# EasyEDA Pro project UAF42_AD620_直流偏置_AD8138全差分.eprj

# Schematic Schematic1

## Sheets
1 P1: Board Name: Board1; Create Date: 2025-03-26; Page Name: P1; Project Name: UAF42_AD620_直流偏置_AD8138全差分; Schematic Name: Schematic1; Update Date: 2025-04-23; Company: 嘉立创EDA; Page Size: A4; Version: V1.0
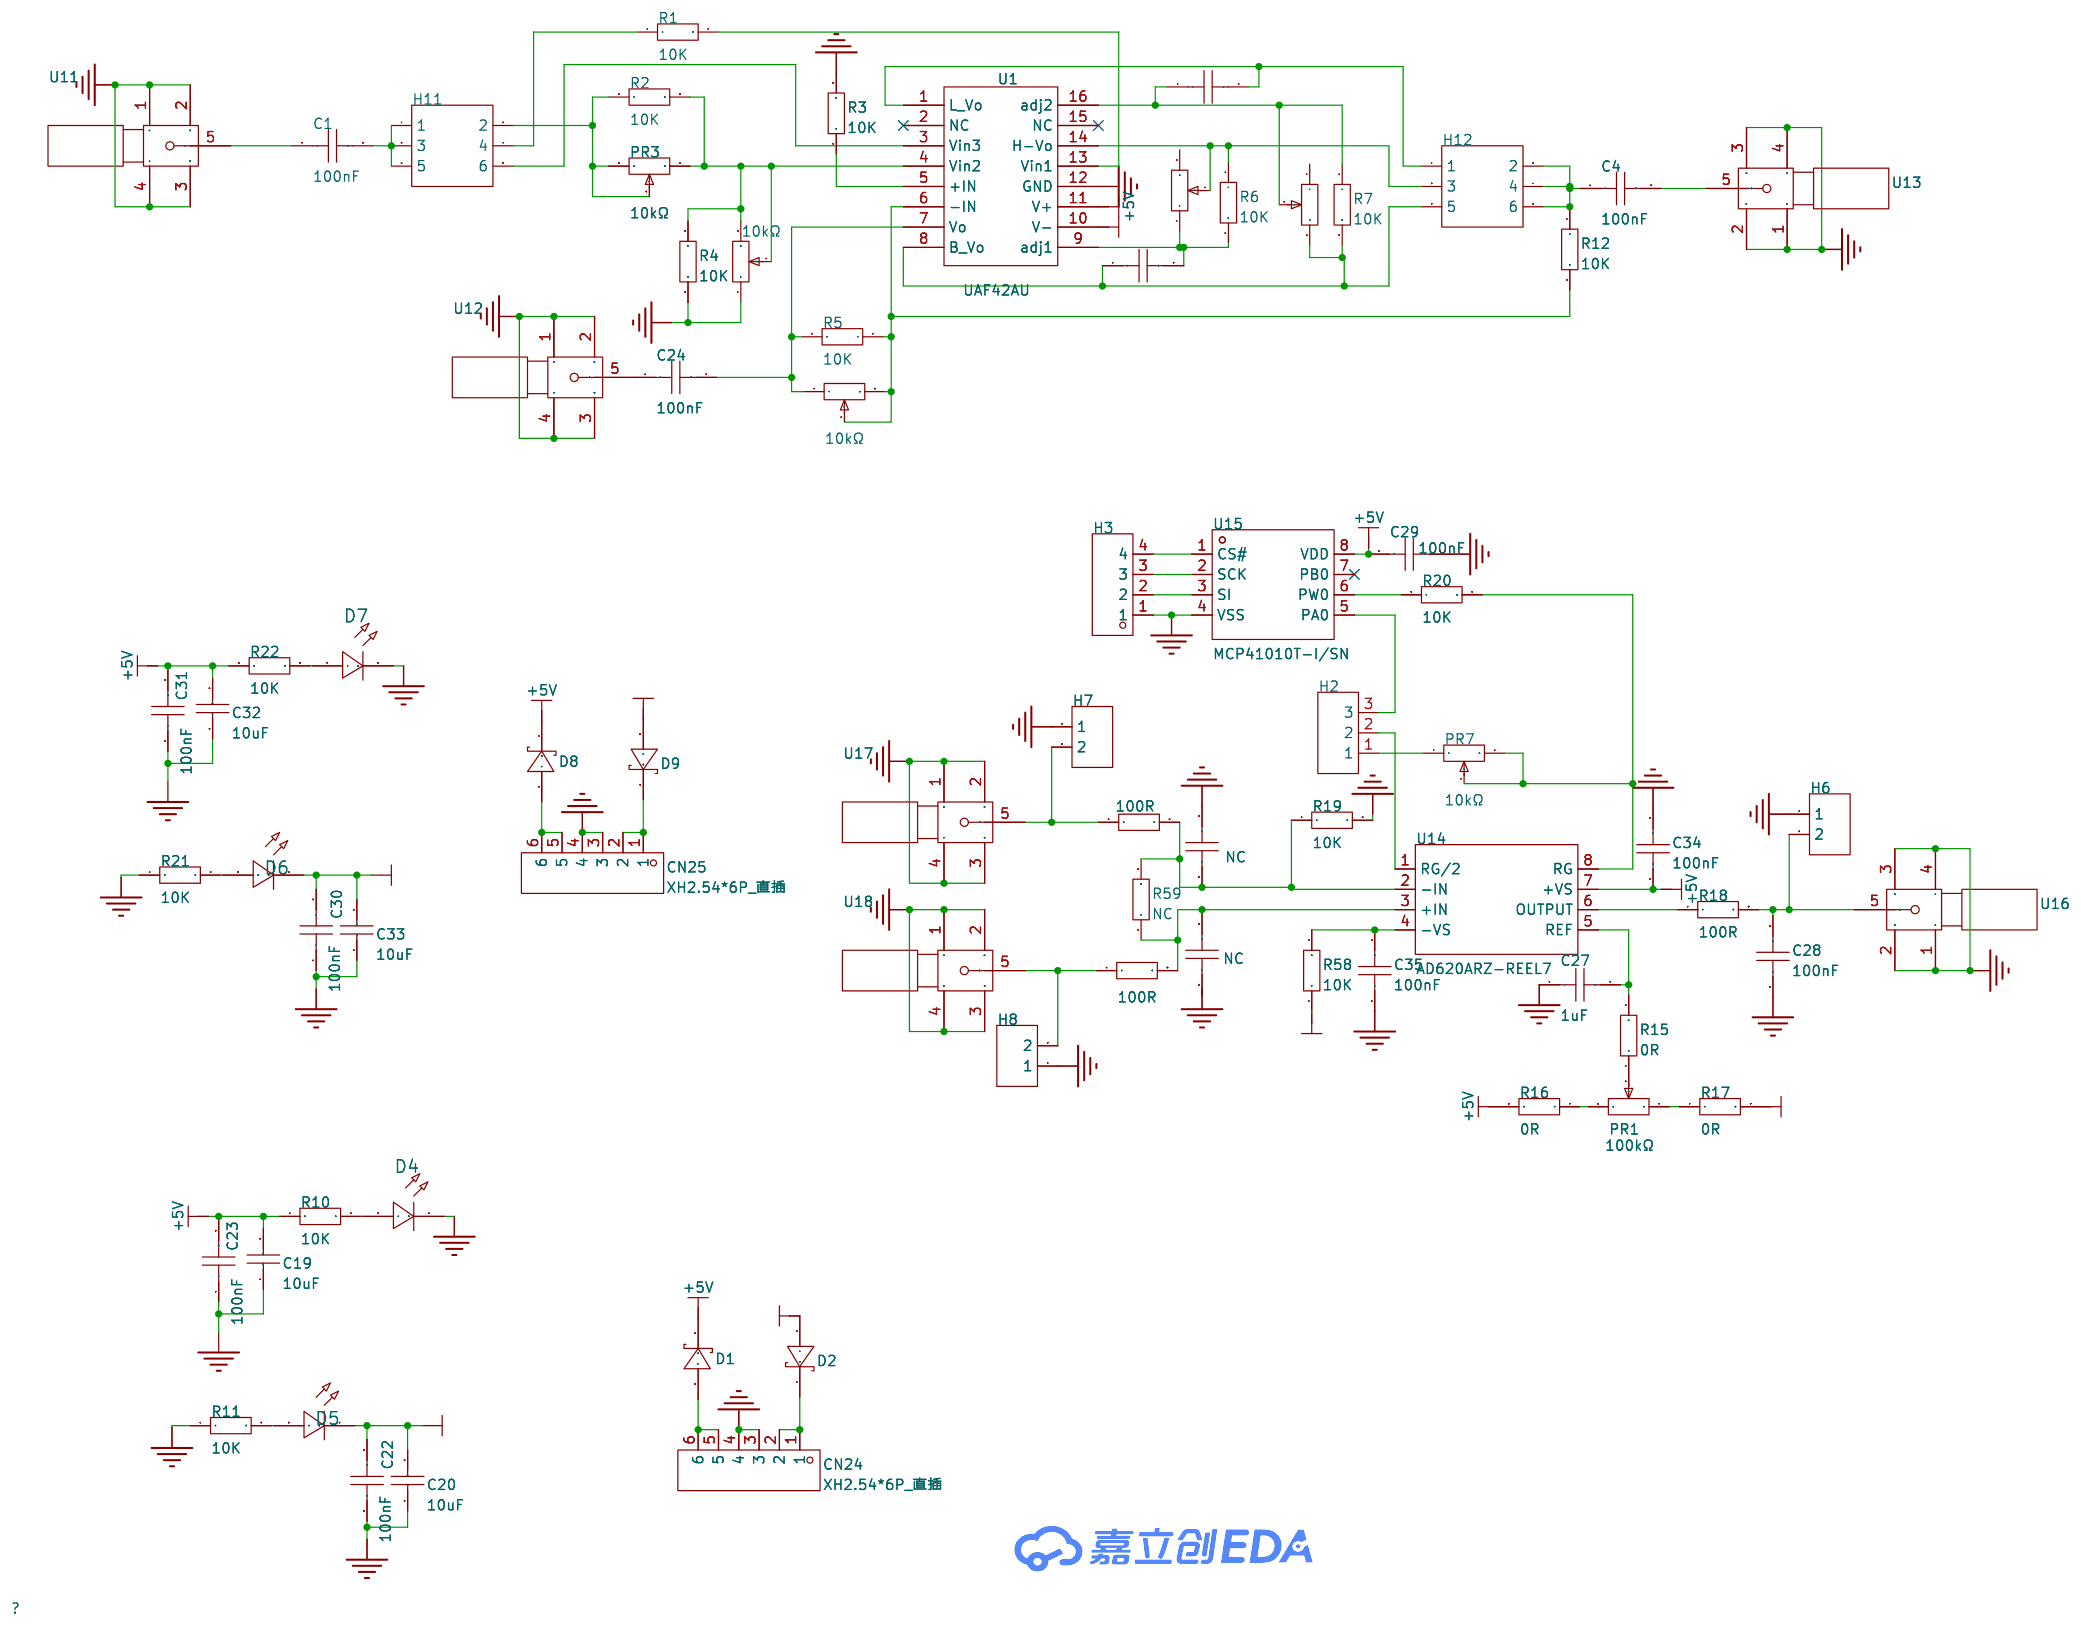
[diagram p0: P1]
2 P2: Create Date: 2025-04-21; Page Name: P2; Update Date: 2025-07-05
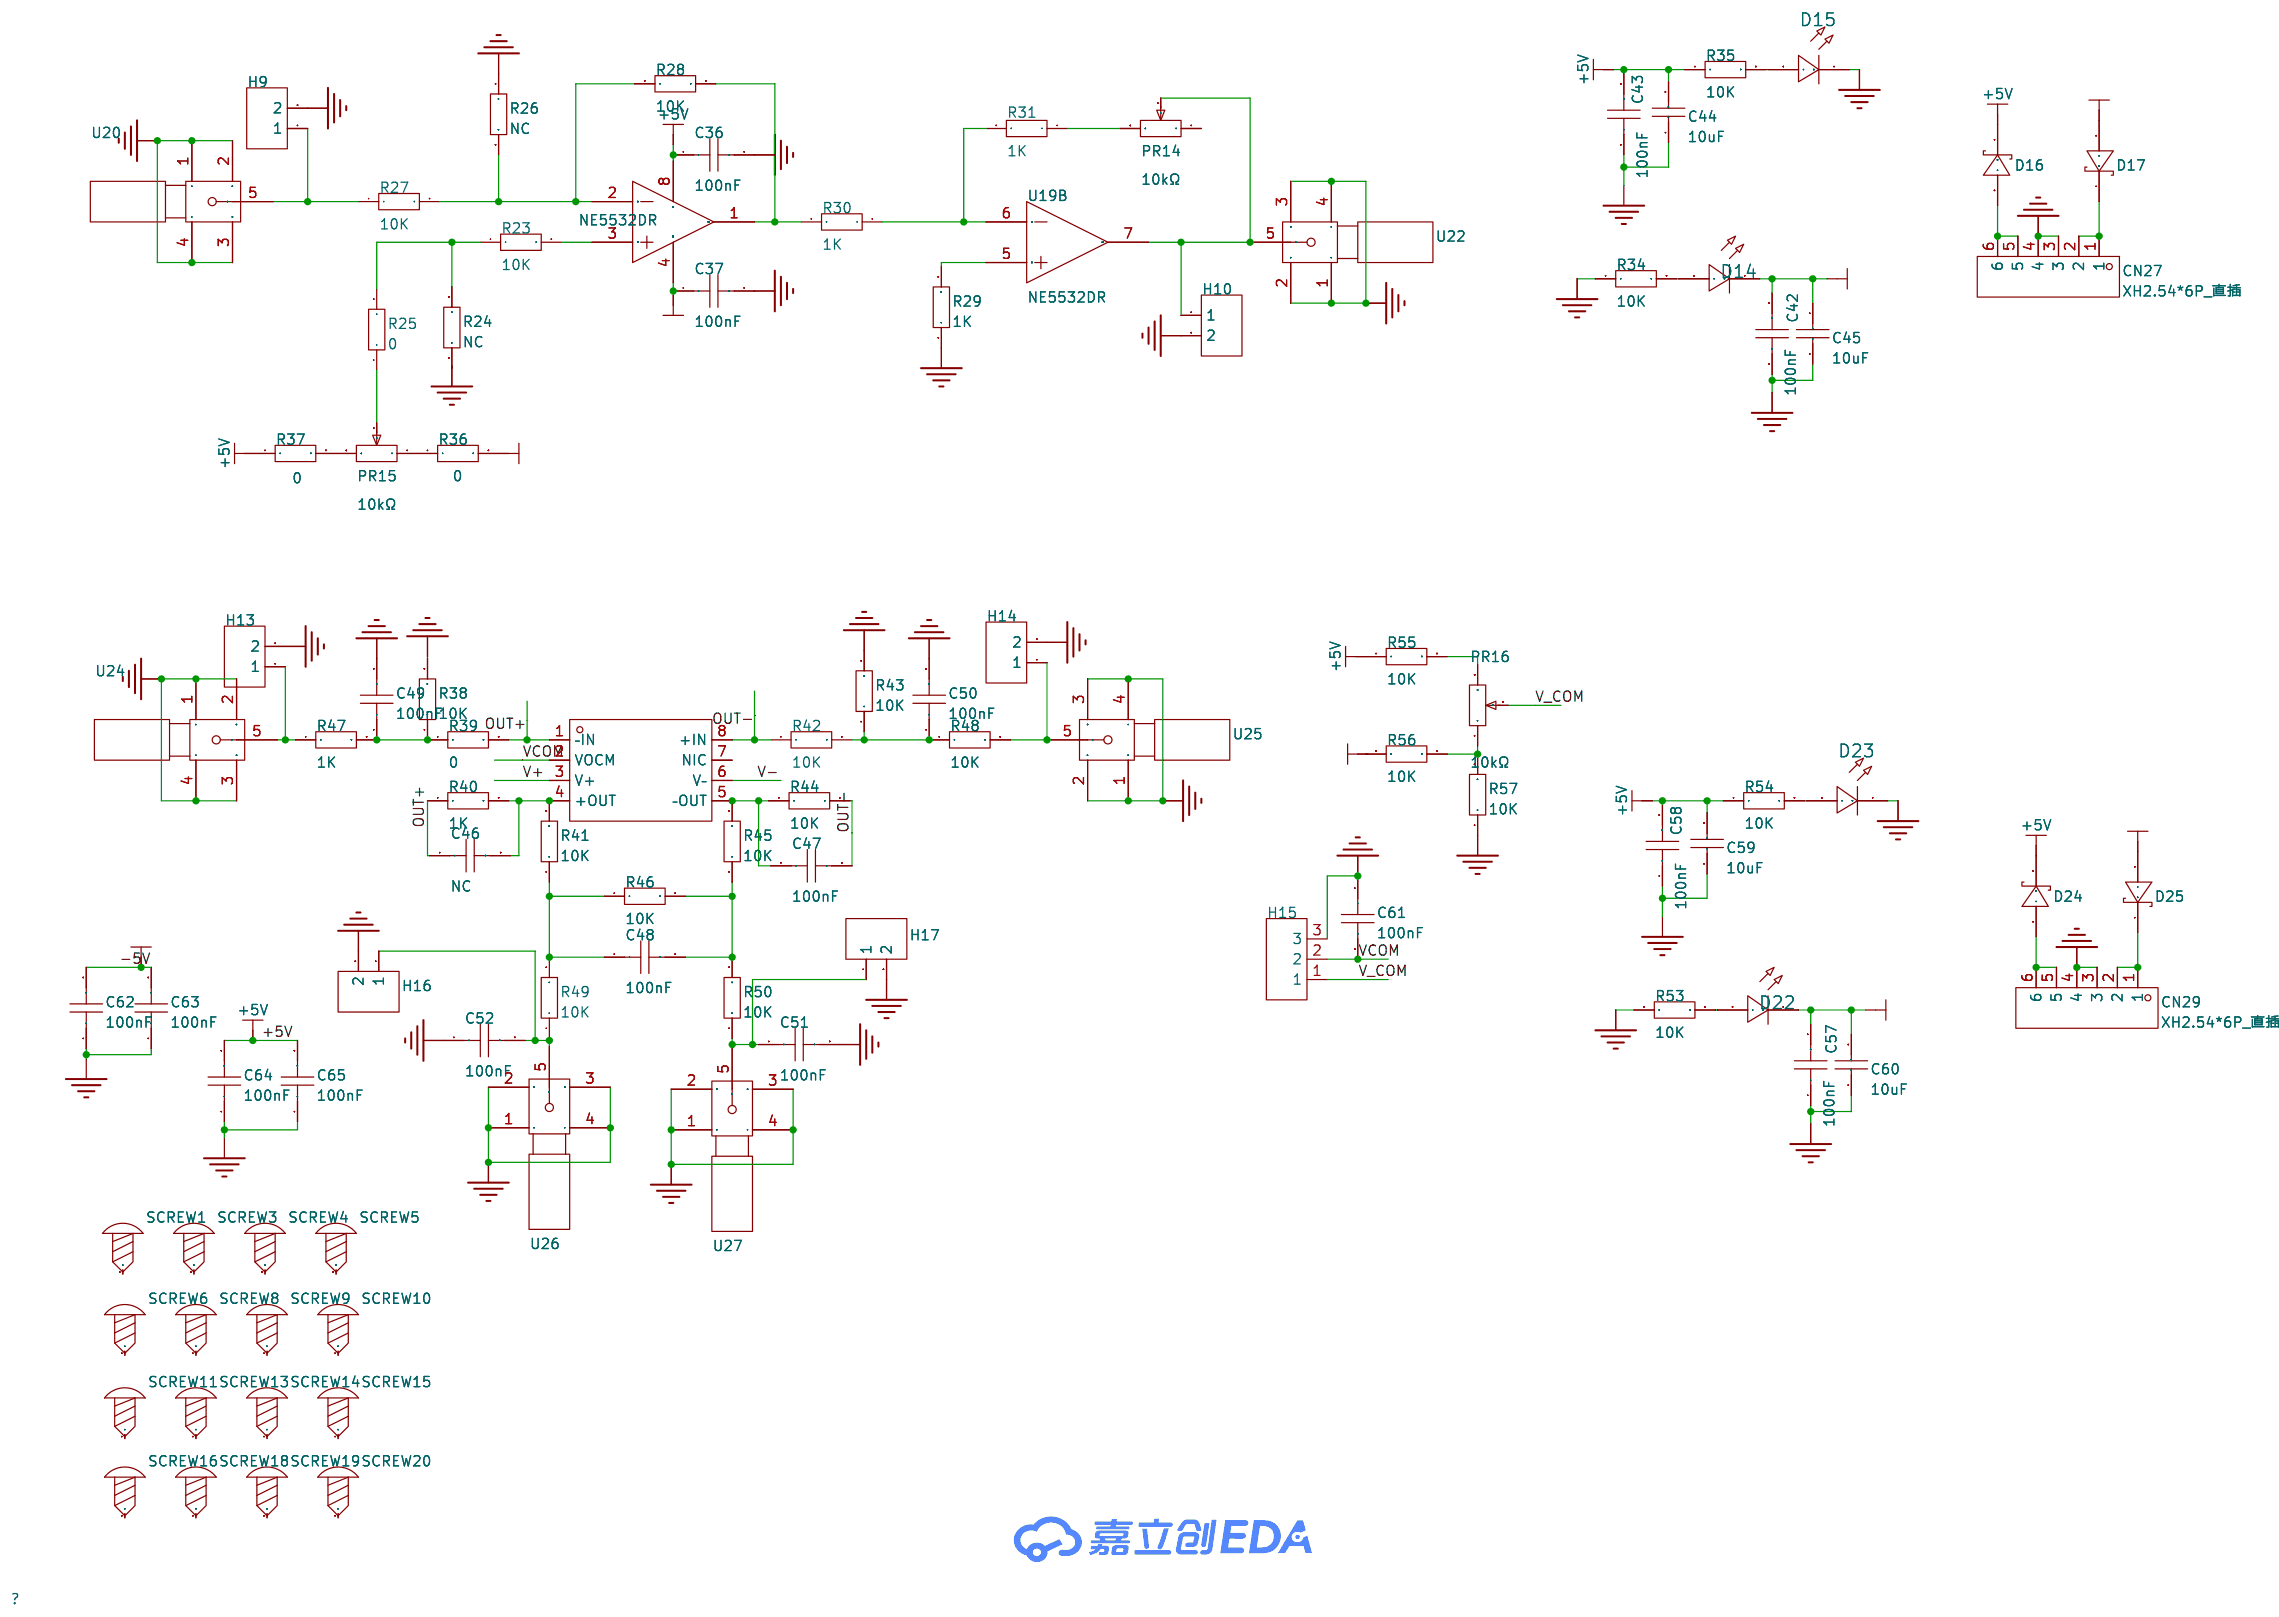
[diagram p1: P2]

## Parts
sheet P1
C1  100nF  [R0805]
C2  100nF  [R0805]
C3  100nF  [R0805]
C4  100nF  [R0805]
C19  10uF  [C1210]
C20  10uF  [C1210]
C22  100nF  [R0805]
C23  100nF  [R0805]
C24  100nF  [R0805]
C25  NC  [R0805]
C26  NC  [R0805]
C27  1uF  [R0805]
C28  100nF  [R0805]
C29  100nF  [R0805]
C30  100nF  [R0805]
C31  100nF  [R0805]
C32  10uF  [C1210]
C33  10uF  [C1210]
C34  100nF  [R0805]
C35  100nF  [R0805]
CN24  XH2.54*6P_直插  [CONN-TH_XH2.54-6P]
CN25  XH2.54*6P_直插  [CONN-TH_XH2.54-6P]
D1  SD103AWS  [SOD-323_L1.8-W1.3-LS2.5-RD]
D2  SD103AWS  [SOD-323_L1.8-W1.3-LS2.5-RD]
D4  -  [LED_0805]
D5  -  [LED_0805]
D6  -  [LED_0805]
D7  -  [LED_0805]
D8  SD103AWS  [SOD-323_L1.8-W1.3-LS2.5-RD]
D9  SD103AWS  [SOD-323_L1.8-W1.3-LS2.5-RD]
H2  -  [HDR-TH_3P-P2.54-V-F]
H3  -  [HDR-TH_4P-P2.54-V-F]
H6  -  [HDR-TH_2P-P2.54-V-F]
H7  -  [HDR-TH_2P-P2.54-V-F]
H8  -  [HDR-TH_2P-P2.54-V-F]
H11  -  [HDR-TH_6P-P2.54-V-F-R2-C3-S2.54]
H12  -  [HDR-TH_6P-P2.54-V-F-R2-C3-S2.54]
PR1  100kΩ  [R_3296]
PR3  10kΩ  [R_3296]
PR4  10kΩ  [R_3296]
PR6  10kΩ  [R_3296]
PR7  10kΩ  [R_3296]
PR9  10kΩ  [R_3296]
PR13  10kΩ  [R_3296]
R1  10K  [R0805]
R2  10K  [R0805]
R3  10K  [R0805]
R4  10K  [R0805]
R5  10K  [R0805]
R6  10K  [R0805]
R7  10K  [R0805]
R10  10K  [R0805]
R11  10K  [R0805]
R12  10K  [R0805]
R13  100R  [R0805]
R14  100R  [R0805]
R15  0R  [R0805]
R16  0R  [R0805]
R17  0R  [R0805]
R18  100R  [R0805]
R19  10K  [R0805]
R20  10K  [R0805]
R21  10K  [R0805]
R22  10K  [R0805]
R58  10K  [R0805]
R59  NC  [R0805]
U1  UAF42AU  [SOIC-16_L10.3-W7.5-P1.27-LS10.3-BL]
U11  -  [SMA]
U12  -  [SMA]
U13  -  [SMA]
U14  AD620ARZ-REEL7  [SOIC-8_L5.0-W4.0-P1.27-LS6.0-BL]
U15  MCP41010T-I/SN  [SOIC-8_L4.9-W3.9-P1.27-LS6.0-BL]
U16  -  [SMA]
U17  -  [SMA]
U18  -  [SMA]
sheet P2
C36  100nF  [R0805]
C37  100nF  [R0805]
C42  100nF  [R0805]
C43  100nF  [R0805]
C44  10uF  [C1210]
C45  10uF  [C1210]
C46  NC  [R0805]
C47  100nF  [R0805]
C48  100nF  [R0805]
C49  100nF  [R0805]
C50  100nF  [R0805]
C51  100nF  [R0805]
C52  100nF  [R0805]
C57  100nF  [R0805]
C58  100nF  [R0805]
C59  10uF  [C1210]
C60  10uF  [C1210]
C61  100nF  [R0805]
C62  100nF  [R0805]
C63  100nF  [R0805]
C64  100nF  [R0805]
C65  100nF  [R0805]
CN27  XH2.54*6P_直插  [CONN-TH_XH2.54-6P]
CN29  XH2.54*6P_直插  [CONN-TH_XH2.54-6P]
D14  -  [LED_0805]
D15  -  [LED_0805]
D16  SD103AWS  [SOD-323_L1.8-W1.3-LS2.5-RD]
D17  SD103AWS  [SOD-323_L1.8-W1.3-LS2.5-RD]
D22  -  [LED_0805]
D23  -  [LED_0805]
D24  SD103AWS  [SOD-323_L1.8-W1.3-LS2.5-RD]
D25  SD103AWS  [SOD-323_L1.8-W1.3-LS2.5-RD]
H9  -  [HDR-TH_2P-P2.54-V-F]
H10  -  [HDR-TH_2P-P2.54-V-F]
H13  -  [HDR-TH_2P-P2.54-V-F]
H14  -  [HDR-TH_2P-P2.54-V-F]
H15  -  [HDR-TH_3P-P2.54-V-F]
H16  -  [HDR-TH_2P-P2.54-V-F]
H17  -  [HDR-TH_2P-P2.54-V-F]
PR14  10kΩ  [R_3296]
PR15  10kΩ  [R_3296]
PR16  10kΩ  [R_3296]
R23  10K  [R0805]
R24  NC  [R0805]
R25  0  [R0805]
R26  NC  [R0805]
R27  10K  [R0805]
R28  10K  [R0805]
R29  1K  [R0805]
R30  1K  [R0805]
R31  1K  [R0805]
R34  10K  [R0805]
R35  10K  [R0805]
R36  0  [R0805]
R37  0  [R0805]
R38  10K  [R0805]
R39  0  [R0805]
R40  1K  [R0805]
R41  10K  [R0805]
R42  10K  [R0805]
R43  10K  [R0805]
R44  10K  [R0805]
R45  10K  [R0805]
R46  10K  [R0805]
R47  1K  [R0805]
R48  10K  [R0805]
R49  10K  [R0805]
R50  10K  [R0805]
R53  10K  [R0805]
R54  10K  [R0805]
R55  10K  [R0805]
R56  10K  [R0805]
R57  10K  [R0805]
SCREW1  -  [M3螺丝]
SCREW3  -  [M3螺丝]
SCREW4  -  [M3螺丝]
SCREW5  -  [M3螺丝]
SCREW6  -  [M3螺丝]
SCREW8  -  [M3螺丝]
SCREW9  -  [M3螺丝]
SCREW10  -  [M3螺丝]
SCREW11  -  [M3螺丝]
SCREW13  -  [M3螺丝]
SCREW14  -  [M3螺丝]
SCREW15  -  [M3螺丝]
SCREW16  -  [M3螺丝]
SCREW18  -  [M3螺丝]
SCREW19  -  [M3螺丝]
SCREW20  -  [M3螺丝]
U19  NE5532DR  [SOIC-8_L4.9-W3.9-P1.27-LS6.0-BL]  (sections 1,2)
U20  -  [SMA]
U22  -  [SMA]
U23  AD8138ARZ-RL  [SOIC-8_L5.0-W4.0-P1.27-LS6.0-BL]
U24  -  [SMA]
U25  -  [SMA]
U26  -  [SMA]
U27  -  [SMA]

## Library data of the parts
C1-C4 C22-C31 C34-C37 C42 C43 C46-C52 C57 C58 C61-C65 = CAP_0805: Supplier Footprint: 0805
C19 C20 C32 C33 C44 C45 C59 C60 = CL32B106KAJNNNE: 容值:10uF;精度:±10%;额定电压:25V;材质(温度系数):X7R;; LCSC Part Name: 10uF ±10% 25V; Supplier Part: C39232; Manufacturer: SAMSUNG(三星); Supplier Footprint: 1210; JLCPCB Part Class: 扩展库; Datasheet: https://atta.szlcsc.com/upload/public/pdf/source/20160218/1457707763339.pdf; Supplier: LCSC; Tolerance: ±10%; Voltage Rated: 25V; Temperature Coefficient: X7R
CN24 CN25 CN27 CN29 = XH2.54*6P_直插: Supplier Part: C9900008614; Supplier Footprint: XH2.54_6P; JLCPCB Part Class: 扩展库; Supplier: LCSC
D1 D2 D8 D9 D16 D17 D24 D25 = SD103AWS_C181207: 正向压降(Vf):600mV@200mA;直流反向耐压(Vr):40V;整流电流:350mA;; LCSC Part Name: 电压:40V 电流:350mA 丝印S4; Supplier Part: C181207; Manufacturer: Hottech(合科泰); Supplier Footprint: SOD-323; JLCPCB Part Class: 扩展库; Datasheet: https://atta.szlcsc.com/upload/public/pdf/source/20240513/4691873FBB9173EFBCF4C6FD4BBA1025.pdf; Supplier: LCSC; Forward Voltage (Vf@If): 600mV@200mA; Reverse Voltage (Vr): 40V; Rectified Current: 350mA
D4-D7 D14 D15 D22 D23 = LED_0805-R: Supplier Footprint: 0805
H2 H15 = HDR-F_2.54_1x3P: Supplier Part: C541850; Supplier Footprint: 插件
H3 = HDR-F_2.54_1x4P: Supplier Part: C2718488; Supplier Footprint: 插件
H6-H10 H13 H14 H16 H17 = HDR-F_2.54_1x2P: Supplier Part: C49661; Supplier Footprint: 插件
H11 H12 = HDR-F_2.54_2x3: Supplier Part: C92272; Supplier Footprint: 插件
PR1 PR3 PR4 PR6 PR7 PR9 PR13-PR16 = R_3296: Supplier Footprint: 直插
R1-R7 R10-R31 R34-R50 R53-R59 = Res_0805: Supplier Footprint: 0805
U1 = UAF42AU: 分辨率:-;工作电压:6V~18V;接口类型:-;; Supplier Part: C12341; Manufacturer: TI(德州仪器); Supplier Footprint: SOIC-16-300mil; JLCPCB Part Class: 扩展库; Datasheet: https://www.ti.com/cn/lit/gpn/uaf42; Supplier: LCSC; Voltage - Supply: 6V~18V; Operating Temperature: -25℃~+85℃
U11-U13 U16-U18 U20 U22 U24-U27 = SMA
U14 = AD620ARZ-REEL7: LCSC Part Name: 低成本低功耗仪表放大器; Supplier Part: C9675; Manufacturer: ADI(亚德诺); Supplier Footprint: SOIC-8; JLCPCB Part Class: Extended Part; Datasheet: https://atta.szlcsc.com/upload/public/pdf/source/20121103/1457706545320.pdf; Supplier: LCSC; Number of Circuits: 单路; Current - Input Bias(Ib): 500pA; Voltage - Input Offset(Vos): 30uV; Slew Rate(SR): 1.2V/us; -3db Bandwidth: 1MHz; Operating Temperature: -40℃~+85℃
U15 = MCP41010T-I/SN: Supplier Part: C136395; Manufacturer: MICROCHIP(美国微芯); Supplier Footprint: SOIC-8-150mil; JLCPCB Part Class: 扩展库; Datasheet: https://atta.szlcsc.com/upload/public/pdf/source/20220205/C2666606_C5E8E7A5F3891B321C1555D845654E7B.pdf; Supplier: LCSC; Resistance Value (Ohms): 10kΩ; Number of Taps: 256; Number of Channels: 1; Precision: ±20%; Supply Voltage: 2.7V~5.5V; Interface Type: SPI; Temperature Coefficient (Typ): 800ppm/℃; Operating Temperature: -40℃~+85℃
SCREW1 SCREW3-SCREW6 SCREW8-SCREW11 SCREW13-SCREW16 SCREW18-SCREW20 = M3螺丝: Supplier Footprint: 插件
U19 = NE5532DR: Supplier Part: C7426; Manufacturer: TI(德州仪器); Supplier Footprint: SOIC-8; JLCPCB Part Class: 基础库; Datasheet: http://www.ti.com/cn/lit/gpn/ne5532; Supplier: LCSC; Number of Circuits: 双路; Gain Bandwidth Product(GBP): 10MHz; Current - Input Bias(Ib): 200nA; Slew Rate(SR): 9V/us; Output Current: 38mA; Supply Current: 8mA; Operating Temperature: 0℃~+70℃
U23 = AD8138ARZ-RL: LCSC Part Name: 低失真差分ADC驱动器; Supplier Part: C652360; Manufacturer: ADI(亚德诺); Supplier Footprint: SOIC-8; JLCPCB Part Class: 扩展库; Datasheet: https://atta.szlcsc.com/upload/public/pdf/source/20181012/C116011_0AC99E88246DC0EB027D01E9C456B8D0.pdf; Supplier: LCSC; Number of Circuits: 单路; Common Mode Rejection Ratio (CMRR): 77dB; Current - Input Bias(Ib): 500nA; Voltage - Input Offset(Vos): 1mV; Slew Rate(SR): 1150V/us; Supply Voltage: 3V~5V; -3db Bandwidth: 320MHz; Output Current: 95mA; Input Offset Voltage Drift (Vos TC): 4uV/℃; Supply Current: 20mA; Operating Temperature: -40℃~+85℃

## Nets
+5V: C19.2 C23.2 C29.1 C31.2 C32.2 C34.1 C36.1 C43.2 C44.2 C58.2 C59.2 C64.2 C65.2 D1.1(C) D8.1(C) D16.1(C) D24.1(C) R10.1 R16.2 R22.1 R35.1 R37.1 R54.1 R55.1 U1.11(V+) U14.7(+VS) U15.8(VDD) U19.8(VCC+)
-5V: C20.2 C22.2 C30.2 C33.2 C37.1 C42.2 C45.2 C57.2 C60.2 C62.2 C63.2 D2.2(A) D5.1(C) D6.1(C) D9.2(A) D14.1(C) D17.2(A) D22.1(C) D25.2(A) R17.2 R36.2 R56.2 R58.1 U1.10(V-) U19.4(VCC-/GND)
GND: C19.1 C20.1 C22.1 C23.1 C25.2 C26.1 C27.1 C28.1 C29.2 C30.1 C31.1 C32.1 C33.1 C34.2 C35.1 C36.2 C37.2 C42.1 C43.1 C44.1 C45.1 C49.2 C50.2 C51.2 C52.1 C57.1 C58.1 C59.1 C60.1 C61.1 C62.1 C63.1 C64.1 C65.1 CN24.3 CN24.4 CN25.3 CN25.4 CN27.3 CN27.4 CN29.3 CN29.4 D4.1(C) D7.1(C) D15.1(C) D23.1(C) H3.1 H6.1 H7.1 H8.1 H9.2 H10.2 H13.2 H14.2 H15.3 H16.2 H17.2 PR9.1 R3.2 R4.1 R11.1 R19.2 R21.1 R24.1 R26.1 R29.1 R34.1 R38.2 R43.2 R53.1 R57.1 U1.12(GND) U11.1 U11.2 U11.3 U11.4 U12.1 U12.2 U12.3 U12.4 U13.1 U13.2 U13.3 U13.4 U15.4(VSS) U16.1 U16.2 U16.3 U16.4 U17.1 U17.2 U17.3 U17.4 U18.1 U18.2 U18.3 U18.4 U20.1 U20.2 U20.3 U20.4 U22.1 U22.2 U22.3 U22.4 U24.1 U24.2 U24.3 U24.4 U25.1 U25.2 U25.3 U25.4 U26.1 U26.2 U26.3 U26.4 U27.1 U27.2 U27.3 U27.4
OUT+: C46.1 R39.2 R40.1 U23.1(–IN)
OUT-: C47.2 R42.1 R44.2 U23.8(+IN)
V+: U23.3(V+)
V-: U23.6(V–)
V_COM: H15.1 PR16.2
VCOM: C61.2 H15.2 U23.2(VOCM)
$1N1182: D5.2(A) R11.2
$1N1188: D4.2(A) R10.2
$1N1389: CN24.5 CN24.6 D1.2(A)
$1N1390: CN24.1 CN24.2 D2.1(C)
$1N1445: R3.1 U1.5(+IN)
$1N1450: R1.2 U1.13(Vin1)
$1N1595: PR3.3 PR9.2 PR9.3 R2.2 R4.2 U1.4(Vin2)
$1N1622: H11.2 PR3.1 PR3.2 R2.1
$1N1784: PR13.2 PR13.3 R5.1 R12.2 U1.6(-IN)
$1N1790: C24.2 PR13.1 R5.2 U1.7(Vo)
$1N1856: H11.6 U1.3(Vin3)
$1N1869: H11.4 R1.1
$1N1910: C2.2 H12.1 U1.1(L_Vo)
$1N1976: C2.1 PR6.2 R7.1 U1.16(adj2)
$1N1981: H12.3 PR4.2 R6.1 U1.14(H-Vo)
$1N2040: C3.2 PR4.1 R6.2 U1.9(adj1)
$1N2142: C4.1 H12.2 H12.4 H12.6 R12.1
$1N2254: C3.1 H12.5 PR6.3 R7.2 U1.8(B_Vo)
$1N2357: C1.2 H11.1 H11.3 H11.5
$1N2379: C1.1 U11.5
$1N2488: C24.1 U12.5
$1N2539: C4.2 U13.5
$1N3084: C25.1 R13.2 R19.1 R59.2 U14.2(-IN)
$1N3090: C26.2 R14.2 R59.1 U14.3(+IN)
$1N3242: R18.1 U14.6(OUTPUT)
$1N3248: C27.2 R15.2 U14.5(REF)
$1N3433: H2.2 U14.1(RG/2)
$1N3547: PR7.2 PR7.3 R20.2 U14.8(RG)
$1N3556: H2.3 U15.5(PA0)
$1N3634: R20.1 U15.6(PW0)
$1N3650: PR1.2 R15.1
$1N3654: PR1.3 R16.1
$1N3658: PR1.1 R17.1
$1N3766: C28.2 H6.2 R18.2 U16.5
$1N3943: H7.2 R13.1 U17.5
$1N3949: H8.2 R14.1 U18.5
$1N4144: H3.4 U15.1(CS#)
$1N4148: H3.3 U15.2(SCK)
$1N4153: H3.2 U15.3(SI)
$1N4622: D7.2(A) R22.2
$1N4631: D6.2(A) R21.2
$1N4633: CN25.1 CN25.2 D9.1(C)
$1N4634: CN25.5 CN25.6 D8.2(A)
$1N4767: C35.2 R58.2 U14.4(-VS)
$1N5205: H2.1 PR7.1
$2N1502: H9.1 R27.1 U20.5
$2N1503: R26.2 R27.2 R28.1 U19.2(IN1-)
$2N1504: R23.1 R24.2 R25.2
$2N1511: CN27.5 CN27.6 D16.2(A)
$2N1513: D14.2(A) R34.2
$2N1515: D15.2(A) R35.2
$2N1521: PR15.1 R36.1
$2N1522: PR15.2 R25.1
$2N1523: PR15.3 R37.2
$2N1527: R28.2 R30.2 U19.1(OUT1)
$2N1528: R30.1 R31.2 U19.6(IN2-)
$2N1531: PR14.3 R31.1
$2N1533: R29.2 U19.5(IN2+)
$2N1535: H10.1 PR14.2 U19.7(OUT2) U22.5
$2N1536: R23.2 U19.3(IN1+)
$2N1574: CN27.1 CN27.2 D17.1(C)
$2N2025: C46.2 R40.2 R41.2 U23.4(+OUT)
$2N2050: C47.1 R44.1 R45.2 U23.5(–OUT)
$2N2321: C48.1 R41.1 R46.1 R49.2
$2N2326: C48.2 R45.1 R46.2 R50.2
$2N2399: C50.1 R42.2 R43.1 R48.1
$2N2476: C49.1 R38.1 R39.1 R47.2
$2N2511: H13.1 R47.1 U24.5
$2N2915: H14.1 R48.2 U25.5
$2N3082: C51.1 H17.1 R50.1 U27.5
$2N3086: C52.2 H16.1 R49.1 U26.5
$2N3632: CN29.5 CN29.6 D24.2(A)
$2N3637: D22.2(A) R53.2
$2N3640: D23.2(A) R54.2
$2N3643: CN29.1 CN29.2 D25.1(C)
$2N3838: PR16.1 R56.1 R57.2
$2N3844: PR16.3 R55.2

Not connected (* = marked no-connect by the designer): PR4 3; PR6 1; PR14 1; SCREW1 1; SCREW3 1; SCREW4 1; SCREW5 1; SCREW6 1; SCREW8 1; SCREW9 1; SCREW10 1; SCREW11 1; SCREW13 1; SCREW14 1; SCREW15 1; SCREW16 1; SCREW18 1; SCREW19 1; SCREW20 1; U1 2(NC)* 15(NC)*; U15 7(PB0)*; U23 7(NIC)

# Board PCB1
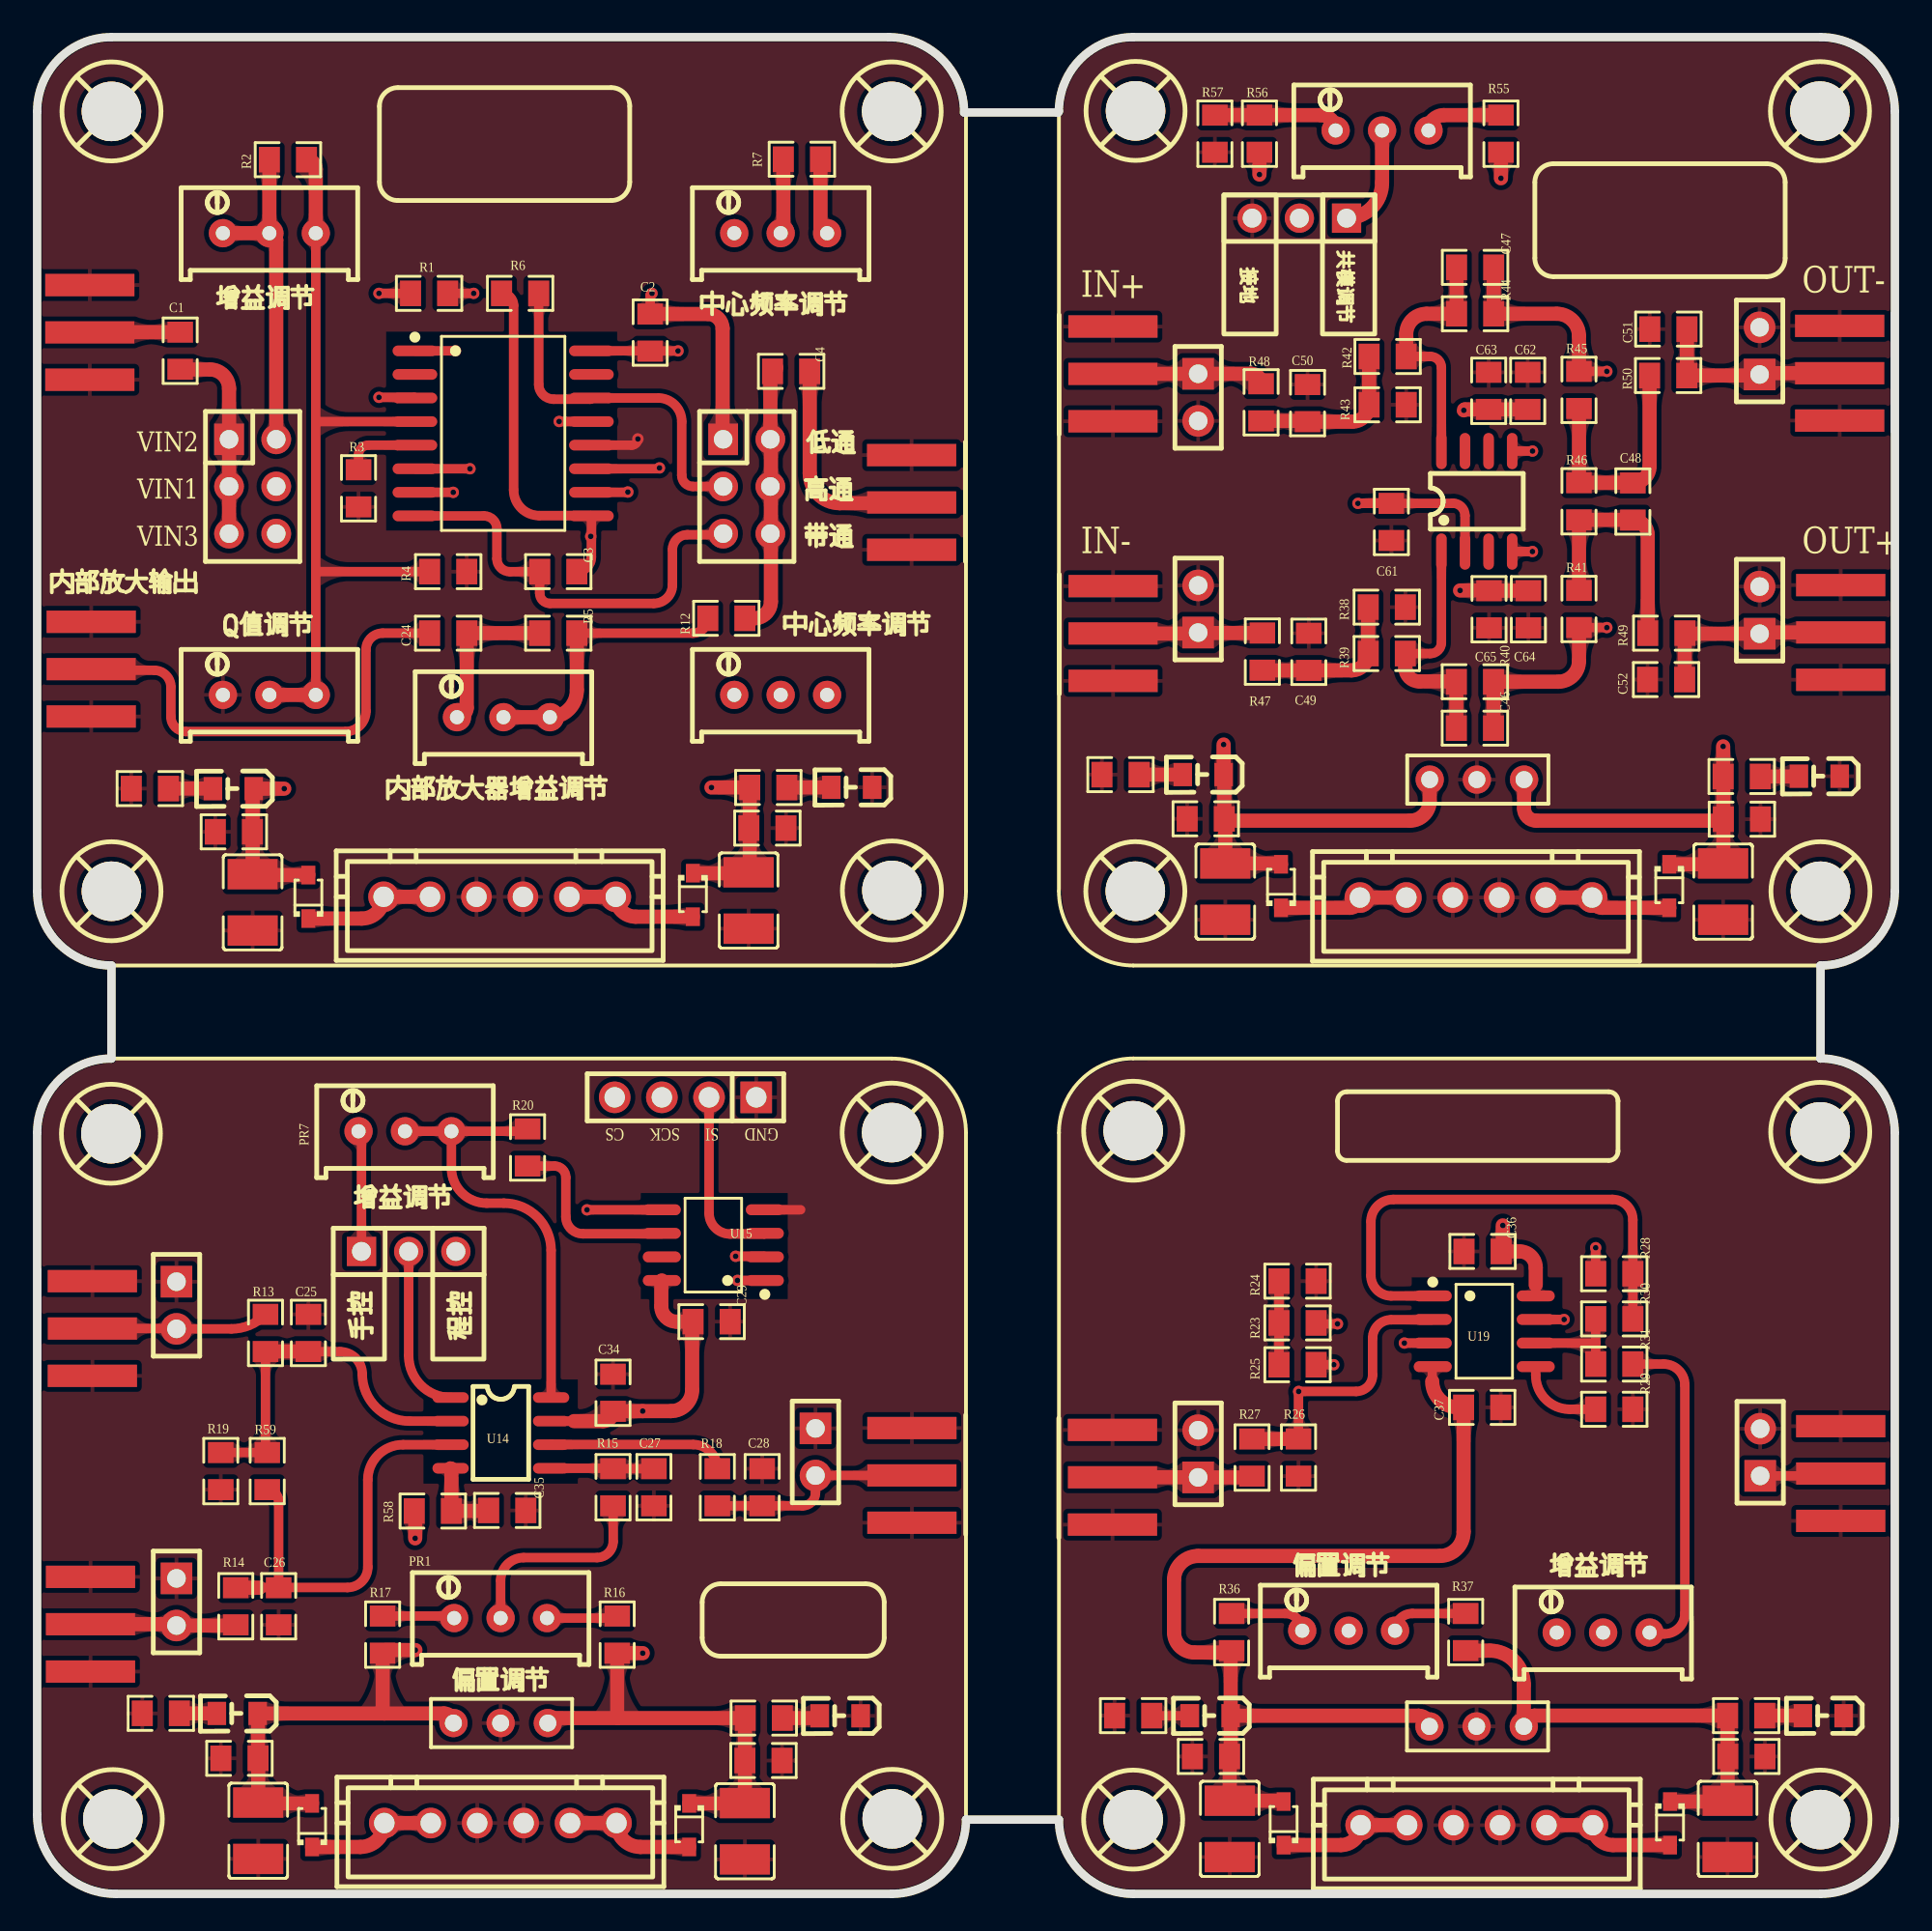
[diagram p2: board, top side]
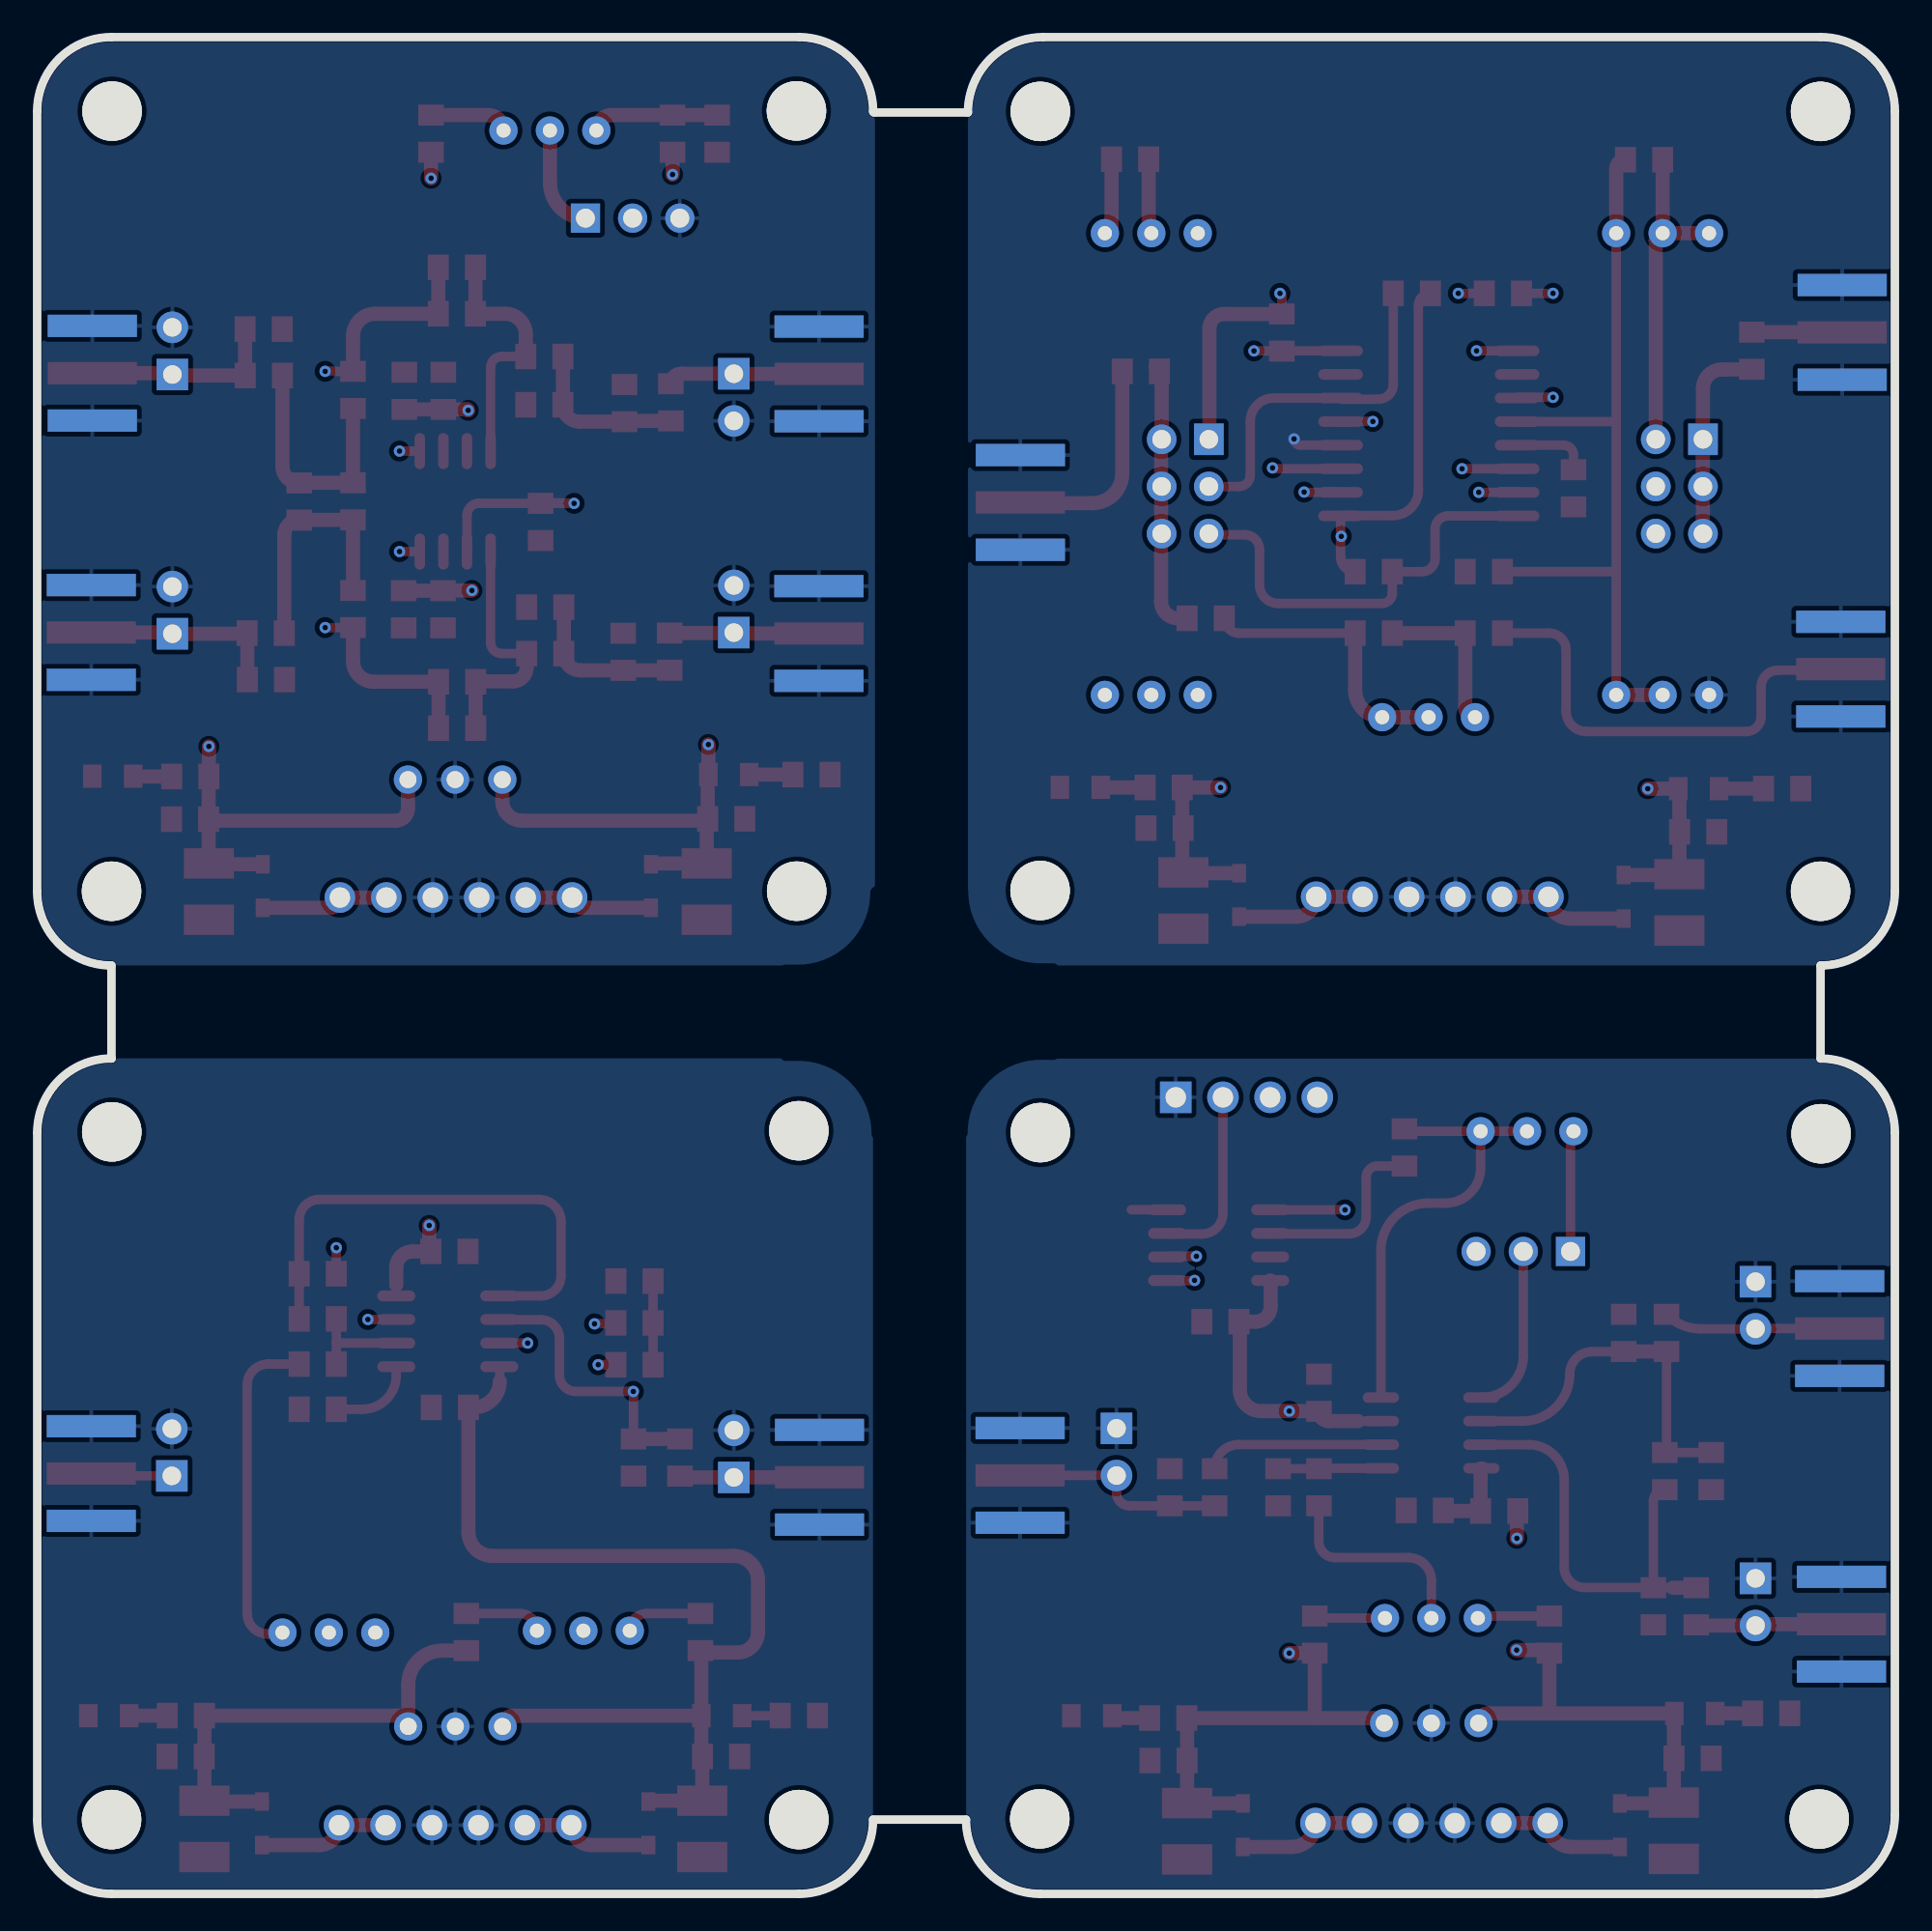
[diagram p3: board, bottom side, seen from below]

Outline 100 x 100 mm; copper layers: Top Layer, 内层1, Inner2, Bottom Layer. Coordinates in mm from the lower left corner of the outline.
Outline path: 0,96 arc(1.17,98.83) 4,100 45.84,100 arc(48.71,98.81) 49.9,95.94 54.94,95.94 arc(54.99,95.96) 55,96 arc(56.18,98.83) 59,100 96,100 arc(98.83,98.83) 100,96 100,54 arc(98.83,51.17) 96,50 96,45 arc(96,44.99) 96,44.99 arc(98.83,43.82) 100,40.99 100,4 arc(98.83,1.17) 96,0 59.01,0 arc(56.18,1.17) 55.01,4 50,4 arc(48.83,1.17) 46,0 4.25,0 arc(1.25,1.25) 0,4.25 0,40.99 arc(1.17,43.82) 4,44.99 4,50 arc(1.17,51.17) 0,54 0,96
Stack: Top Layer 0.035mm 外层铜厚1oz / Dielectric1 0.2104mm 7628 RC49% 8.6mil / 内层1 0.0152mm 内层铜厚 / Dielectric2 1.065mm 1.1mm H/HOZ Copper / Inner2 0.0152mm 内层铜厚 / Dielectric3 0.2104mm 7628 RC49% 8.6mil / Bottom Layer 0.035mm 外层铜厚1oz

## Design rules (mm)
template: 自定义配置
spacing copperThickness1oz (default): track to track 0.102, other pairs 0.152 to 0.3
spacing copperThickness2oz: track to track 0.203, other pairs 0.152 to 0.3
track width copperThickness1oz (default): min 0.127, default 0.508, max 2.54
track width copperThickness2oz: min 0.203, default 0.254, max 2.54
differential pair differentialPair (default): width min 0.127, default 0.254, max 2.54; gap min 0.152, default 0.152
via viaSize (default): diameter min 0.5, default 0.61, max 10; hole min 0.3, default 0.305, max 6.3

## Placement (name value [footprint] x y rotation side)
C1  100nF  [R0805]  7.7 83 270 top
C2  100nF  [R0805]  33 84.2 90 top
C3  100nF  [R0805]  28.16 71.21 0 top
C4  100nF  [R0805]  40.7 82 0 top
C19  10uF  [C1210]  38.3 53.5 90 top
C20  10uF  [C1210]  11.6 53.4 90 top
C22  100nF  [R0805]  10.7 57.2 0 top
C23  100nF  [R0805]  39.2 57.4 180 top
C24  100nF  [R0805]  22.24 67.9 0 top
C25  NC  [R0805]  14.6 30.32 90 top
C26  NC  [R0805]  13 15.6 90 top
C27  1uF  [R0805]  33.2 22.01 90 top
C28  100nF  [R0805]  39.03 21.79 270 top
C29  100nF  [R0805]  36.42 30.82 0 top
C30  100nF  [R0805]  11 7.3 0 top
C31  100nF  [R0805]  38.99 7.18 180 top
C32  10uF  [C1210]  38.1 3.37 90 top
C33  10uF  [C1210]  11.9 3.4 90 top
C34  100nF  [R0805]  31 27.1 90 top
C35  100nF  [R0805]  25.19 20.65 180 top
C36  100nF  [R0805]  77.7 34.6 180 top
C37  100nF  [R0805]  77.9 26.2 0 top
C42  100nF  [R0805]  63.3 7.4 0 top
C43  100nF  [R0805]  91.9 7.4 180 top
C44  10uF  [C1210]  91 3.5 90 top
C45  10uF  [C1210]  64.2 3.5 90 top
C46  NC  [R0805]  77.51 62.78 0 top
C47  100nF  [R0805]  77.3 87.6 180 top
C48  100nF  [R0805]  85.9 75.1 90 top
C49  100nF  [R0805]  68.46 67.01 90 top
C50  100nF  [R0805]  68.39 80.4 90 top
C51  100nF  [R0805]  87.7 84.28 180 top
C52  100nF  [R0805]  87.8 65.4 0 top
C57  100nF  [R0805]  63.02 57.9 0 top
C58  100nF  [R0805]  91.66 57.88 180 top
C59  10uF  [C1210]  90.76 53.98 90 top
C60  10uF  [C1210]  63.96 53.98 90 top
C61  100nF  [R0805]  72.9 74 90 top
C62  100nF  [R0805]  80.24 80.84 270 top
C63  100nF  [R0805]  78.14 80.84 270 top
C64  100nF  [R0805]  80.28 69.3 90 top
C65  100nF  [R0805]  78.16 69.3 90 top
CN24  XH2.54*6P_直插  [CONN-TH_XH2.54-6P]  24.9 53.7 0 top
CN25  XH2.54*6P_直插  [CONN-TH_XH2.54-6P]  24.94 3.81 0 top
CN27  XH2.54*6P_直插  [CONN-TH_XH2.54-6P]  77.5 3.7 0 top
CN29  XH2.54*6P_直插  [CONN-TH_XH2.54-6P]  77.46 53.66 0 top
D1  SD103AWS  [SOD-323_L1.8-W1.3-LS2.5-RD]  35.3 53.8 270 top
D2  SD103AWS  [SOD-323_L1.8-W1.3-LS2.5-RD]  14.6 53.7 90 top
D4  -  [LED_0805]  43.8 59.6 180 top
D5  -  [LED_0805]  10.51 59.53 180 top
D6  -  [LED_0805]  10.72 9.72 180 top
D7  -  [LED_0805]  43.18 9.59 180 top
D8  SD103AWS  [SOD-323_L1.8-W1.3-LS2.5-RD]  35.1 3.7 270 top
D9  SD103AWS  [SOD-323_L1.8-W1.3-LS2.5-RD]  14.8 3.7 90 top
D14  -  [LED_0805]  63.1 9.6 180 top
D15  -  [LED_0805]  96.1 9.6 180 top
D16  SD103AWS  [SOD-323_L1.8-W1.3-LS2.5-RD]  87.9 3.8 270 top
D17  SD103AWS  [SOD-323_L1.8-W1.3-LS2.5-RD]  67.1 3.8 90 top
D22  -  [LED_0805]  62.72 60.29 180 top
D23  -  [LED_0805]  95.88 60.2 180 top
D24  SD103AWS  [SOD-323_L1.8-W1.3-LS2.5-RD]  87.86 54.28 270 top
D25  SD103AWS  [SOD-323_L1.8-W1.3-LS2.5-RD]  66.96 54.28 90 top
H2  -  [HDR-TH_3P-P2.54-V-F]  20 34.6 0 top
H3  -  [HDR-TH_4P-P2.54-V-F]  34.9 42.9 180 top
H6  -  [HDR-TH_2P-P2.54-V-F]  41.9 23.8 270 top
H7  -  [HDR-TH_2P-P2.54-V-F]  7.5 31.7 270 top
H8  -  [HDR-TH_2P-P2.54-V-F]  7.5 15.72 270 top
H9  -  [HDR-TH_2P-P2.54-V-F]  62.5 23.7 90 top
H10  -  [HDR-TH_2P-P2.54-V-F]  92.75 23.78 90 top
H11  -  [HDR-TH_6P-P2.54-V-F-R2-C3-S2.54]  11.6 75.8 270 top
H12  -  [HDR-TH_6P-P2.54-V-F-R2-C3-S2.54]  38.2 75.8 270 top
H13  -  [HDR-TH_2P-P2.54-V-F]  62.5 69.2 90 top
H14  -  [HDR-TH_2P-P2.54-V-F]  62.5 80.6 270 top
H15  -  [HDR-TH_3P-P2.54-V-F]  67.95 90.25 180 top
H16  -  [HDR-TH_2P-P2.54-V-F]  92.72 69.14 90 top
H17  -  [HDR-TH_2P-P2.54-V-F]  92.72 83.1 90 top
NOREF  -  [Pad_e98]  27.49 9.2 0 top
NOREF#2  -  [Pad_e201]  74.95 9.02 0 top
NOREF#3  -  [Pad_e200]  80.03 9.02 0 top
NOREF#4  -  [Pad_e275]  80.04 60.01 0 top
NOREF#5  -  [Pad_e95]  22.41 9.2 0 top
NOREF#6  -  [Pad_e96]  24.95 9.2 0 top
NOREF#7  -  [Pad_e262]  74.96 60.01 0 top
NOREF#8  -  [Pad_e199]  77.49 9.02 0 top
NOREF#9  -  [Pad_e263]  77.5 60.01 0 top
PR1  100kΩ  [R_3296]  24.95 14.98 0 top
PR3  10kΩ  [R_3296]  12.5 89.57 0 top
PR4  10kΩ  [R_3296]  40.03 64.7 0 top
PR6  10kΩ  [R_3296]  40.03 89.57 0 top
PR7  10kΩ  [R_3296]  19.8 41.2 0 top
PR9  10kΩ  [R_3296]  12.5 64.7 0 top
PR13  10kΩ  [R_3296]  25.1 63.5 0 top
PR14  10kΩ  [R_3296]  84.3 14.2 0 top
PR15  10kΩ  [R_3296]  70.6 14.3 0 top
PR16  10kΩ  [R_3296]  72.4 95.1 0 top
R1  10K  [R0805#2]  21.1 86.2 0 top
R2  10K  [R0805#2]  13.5 93.4 0 top
R3  10K  [R0805#2]  17.3 75.7 270 top
R4  10K  [R0805#2]  22.13 71.21 180 top
R5  10K  [R0805#2]  28.05 67.9 180 top
R6  10K  [R0805#2]  26 86.2 180 top
R7  10K  [R0805#2]  41.17 93.42 0 top
R10  10K  [R0805#2]  39.36 59.59 0 top
R11  10K  [R0805#2]  6.07 59.53 0 top
R12  10K  [R0805#2]  37.1 68.7 180 top
R13  100R  [R0805#2]  12.29 30.21 270 top
R14  100R  [R0805#2]  10.69 15.49 90 top
R15  0R  [R0805#2]  31 21.9 90 top
R16  0R  [R0805#2]  31.22 13.96 270 top
R17  0R  [R0805#2]  18.6 13.96 270 top
R18  100R  [R0805#2]  36.62 21.9 270 top
R19  10K  [R0805#2]  9.89 22.77 270 top
R20  10K  [R0805#2]  26.4 40.2 90 top
R21  10K  [R0805#2]  6.66 9.72 0 top
R22  10K  [R0805#2]  39.12 9.47 0 top
R23  10K  [R0805#2]  67.85 30.75 0 top
R24  NC  [R0805#2]  67.85 33 180 top
R25  0  [R0805#2]  67.85 28.5 180 top
R26  NC  [R0805#2]  67.9 23.5 90 top
R27  10K  [R0805#2]  65.4 23.5 90 top
R28  10K  [R0805#2]  84.9 33.4 0 top
R29  1K  [R0805#2]  84.9 26.1 180 top
R30  1K  [R0805#2]  84.9 30.97 0 top
R31  1K  [R0805#2]  84.9 28.53 180 top
R34  10K  [R0805#2]  59 9.6 0 top
R35  10K  [R0805#2]  92 9.6 0 top
R36  0  [R0805#2]  64.3 14.1 270 top
R37  0  [R0805#2]  76.9 14.1 90 top
R38  10K  [R0805#2]  72.65 69.3 0 top
R39  0  [R0805#2]  72.65 66.8 0 top
R40  1K  [R0805#2]  77.4 65.28 0 top
R41  10K  [R0805#2]  83 69.2 270 top
R42  10K  [R0805#2]  72.7 82.8 180 top
R43  10K  [R0805#2]  72.7 80.2 0 top
R44  10K  [R0805#2]  77.41 85.1 180 top
R45  10K  [R0805#2]  83 81 90 top
R46  10K  [R0805#2]  83 75 90 top
R47  1K  [R0805#2]  65.96 66.91 270 top
R48  10K  [R0805#2]  65.89 80.33 90 top
R49  10K  [R0805#2]  87.7 67.9 180 top
R50  10K  [R0805#2]  87.8 81.78 180 top
R53  10K  [R0805#2]  58.32 60.28 0 top
R54  10K  [R0805#2]  91.76 60.18 0 top
R55  10K  [R0805#2]  78.8 94.8 90 top
R56  10K  [R0805#2]  65.8 94.8 270 top
R57  10K  [R0805#2]  63.4 94.8 90 top
R58  10K  [R0805#2]  21.3 20.62 0 top
R59  NC  [R0805#2]  12.39 22.77 90 top
SCREW1  -  [M3螺丝]  46 41 0 top
SCREW3  -  [M3螺丝]  96 54 0 top
SCREW4  -  [M3螺丝]  59.12 54 0 top
SCREW5  -  [M3螺丝]  4 96 0 top
SCREW6  -  [M3螺丝]  96 4 0 top
SCREW8  -  [M3螺丝]  59 41.1 0 top
SCREW9  -  [M3螺丝]  95.97 96.02 0 top
SCREW10  -  [M3螺丝]  46 96 0 top
SCREW11  -  [M3螺丝]  59 4 0 top
SCREW13  -  [M3螺丝]  59.13 96.03 0 top
SCREW14  -  [M3螺丝]  4.07 4.03 0 top
SCREW15  -  [M3螺丝]  4 54 0 top
SCREW16  -  [M3螺丝]  95.99 41.04 0 top
SCREW18  -  [M3螺丝]  46.03 4.04 0 top
SCREW19  -  [M3螺丝]  3.97 40.94 0 top
SCREW20  -  [M3螺丝]  46.01 54.04 0 top
U1  UAF42AU  [SOIC-16_L10.3-W7.5-P1.27-LS10.3-BL]  25.09 78.66 270 top
U11  -  [SMA]  -0.97 78.24 0 top
U12  -  [SMA]  -0.9 60.1 0 top
U13  -  [SMA]  50.88 80.8 180 top
U14  AD620ARZ-REEL7  [SOIC-8_L5.0-W4.0-P1.27-LS6.0-BL]  24.96 24.83 270 top
U15  MCP41010T-I/SN  [SOIC-8_L4.9-W3.9-P1.27-LS6.0-BL]  36.4 34.94 90 top
U16  -  [SMA]  50.9 28.4 180 top
U17  -  [SMA]  -0.84 24.59 0 top
U18  -  [SMA]  -0.94 8.66 0 top
U19  NE5532DR  [SOIC-8_L4.9-W3.9-P1.27-LS6.0-BL]  77.9 30.3 270 top
U20  -  [SMA]  54.08 16.57 0 top
U22  -  [SMA]  100.9 28.5 180 top
U23  AD8138ARZ-RL  [SOIC-8_L5.0-W4.0-P1.27-LS6.0-BL]  77.5 75 0 top
U24  -  [SMA]  54.11 62.02 0 top
U25  -  [SMA]  54.1 76 0 top
U26  -  [SMA]  100.9 73.8 180 top
U27  -  [SMA]  100.84 87.76 180 top

## Footprints (pads in the part's own frame, mm; a bottom-side part is the same pattern mirrored in y, then rotated)
C1210
  rect 1.635x2.7 smd: 1(-1.518,0) 2(1.518,0)
CONN-TH_XH2.54-6P
  round 1.65 hole 1.1: 1(-6.25,0) 2(-3.75,0) 3(-1.25,0) 4(1.25,0) 5(3.75,0) 6(6.25,0)
HDR-TH_2P-P2.54-V-F
  rect 1.7x1.7 hole 1: 1(-1.27,0)
  round 1.7 hole 1: 2(1.27,0)
HDR-TH_3P-P2.54-V-F
  rect 1.575x1.575 hole 1.02: 1(-2.54,0)
  round 1.575 hole 1.02: 2(0,0) 3(2.54,0)
HDR-TH_4P-P2.54-V-F
  rect 1.7x1.7 hole 1.1: 1(-3.81,0)
  round 1.7 hole 1.1: 2(-1.27,0) 3(1.27,0) 4(3.81,0)
HDR-TH_6P-P2.54-V-F-R2-C3-S2.54
  rect 1.7x1.6 hole 1: 1(-2.54,-1.27)
  round 1.6 hole 1: 2(-2.54,1.27) 3(0,-1.27) 4(0,1.27) 5(2.54,-1.27) 6(2.54,1.27)
LED_0805
  rect 1x1.25 smd: 1(-1.15,0.005) 2(1.05,0.005)
M3螺丝
  round 3.2 hole 3.2: 1(0,0)
Pad_e95
  round 1.524 hole 0.914: 1(0,0)
Pad_e96
  round 1.524 hole 0.914: 2(0,0)
Pad_e98
  round 1.524 hole 0.914: 1(0,0)
Pad_e199
  round 1.524 hole 0.914: 2(0,0)
Pad_e200
  round 1.524 hole 0.914: 1(0,0)
Pad_e201
  round 1.524 hole 0.914: 1(0,0)
Pad_e262
  round 1.524 hole 0.914: 1(0,0)
Pad_e263
  round 1.524 hole 0.914: 2(0,0)
Pad_e275
  round 1.524 hole 0.914: 1(0,0)
R0805
  rect 1.133x1.377 smd: 1(-1.111,0) 2(0.889,0)
R0805#2
  rect 1.133x1.377 smd: 1(-1,0) 2(1,0)
R_3296
  round 1.524 hole 0.762: 1(-2.499,-0.127) 2(0,-0.127) 3(2.499,-0.127)
SMA
  rect 4.8x1.2 smd: 1(3.81,8.412) 2(3.81,3.312) 5(3.81,5.862)
  rect 4.8x1.2 smd far side: 3(3.81,3.312) 4(3.81,8.412)
SOD-323_L1.8-W1.3-LS2.5-RD
  rect 1x0.75 smd: 1(-1.173,0) 2(1.173,0)
SOIC-8_L4.9-W3.9-P1.27-LS6.0-BL
  oval 0.588x2.045 smd: 1(-1.905,-2.772) 2(-0.635,-2.772) 3(0.635,-2.772) 4(1.905,-2.772) 5(1.905,2.772) 6(0.635,2.772) 7(-0.635,2.772) 8(-1.905,2.772)
SOIC-8_L5.0-W4.0-P1.27-LS6.0-BL
  oval 0.569x1.95 smd: 1(-1.905,-2.705) 2(-0.635,-2.705) 3(0.635,-2.705) 4(1.905,-2.705) 5(1.905,2.705) 6(0.635,2.705) 7(-0.635,2.705) 8(-1.905,2.705)
SOIC-16_L10.3-W7.5-P1.27-LS10.3-BL
  oval 0.574x2.401 smd: 1(-4.445,-4.75) 2(-3.175,-4.75) 3(-1.905,-4.75) 4(-0.635,-4.75) 5(0.635,-4.75) 6(1.905,-4.75) 7(3.175,-4.75) 8(4.445,-4.75) 9(4.445,4.75) 10(3.175,4.75) 11(1.905,4.75) 12(0.635,4.75) 13(-0.635,4.75) 14(-1.905,4.75) 15(-3.175,4.75) 16(-4.445,4.75)

## Nets
As in the schematic, except:
+5V: C19.2 C23.2 C29.1 C31.2 C32.2 C34.1 C36.1 C43.2 C44.2 C58.2 C59.2 C64.2 C65.2 D1.1 D8.1 D16.1 D24.1 NOREF.1 NOREF#3.1 NOREF#4.1 R10.1 R16.2 R22.1 R35.1 R37.1 R54.1 R55.1 U1.11 U14.7 U15.8 U19.8
-5V: C20.2 C22.2 C30.2 C33.2 C37.1 C42.2 C45.2 C57.2 C60.2 C62.2 C63.2 D2.2 D5.1 D6.1 D9.2 D14.1 D17.2 D22.1 D25.2 NOREF#2.1 NOREF#5.1 NOREF#7.1 R17.2 R36.2 R56.2 R58.1 U1.10 U19.4
GND: C19.1 C20.1 C22.1 C23.1 C25.2 C26.1 C27.1 C28.1 C29.2 C30.1 C31.1 C32.1 C33.1 C34.2 C35.1 C36.2 C37.2 C42.1 C43.1 C44.1 C45.1 C49.2 C50.2 C51.2 C52.1 C57.1 C58.1 C59.1 C60.1 C61.1 C62.1 C63.1 C64.1 C65.1 CN24.3 CN24.4 CN25.3 CN25.4 CN27.3 CN27.4 CN29.3 CN29.4 D4.1 D7.1 D15.1 D23.1 H3.1 H6.1 H7.1 H8.1 H9.2 H10.2 H13.2 H14.2 H15.3 H16.2 H17.2 NOREF#6.2 NOREF#8.2 NOREF#9.2 PR9.1 R3.2 R4.1 R11.1 R19.2 R21.1 R24.1 R26.1 R29.1 R34.1 R38.2 R43.2 R53.1 R57.1 U1.12 U11.1 U11.2 U11.3 U11.4 U12.1 U12.2 U12.3 U12.4 U13.1 U13.2 U13.3 U13.4 U15.4 U16.1 U16.2 U16.3 U16.4 U17.1 U17.2 U17.3 U17.4 U18.1 U18.2 U18.3 U18.4 U20.1 U20.2 U20.3 U20.4 U22.1 U22.2 U22.3 U22.4 U24.1 U24.2 U24.3 U24.4 U25.1 U25.2 U25.3 U25.4 U26.1 U26.2 U26.3 U26.4 U27.1 U27.2 U27.3 U27.4

Pads without a net: PR4 3; PR6 1; PR14 1; SCREW1 1; SCREW3 1; SCREW4 1; SCREW5 1; SCREW6 1; SCREW8 1; SCREW9 1; SCREW10 1; SCREW11 1; SCREW13 1; SCREW14 1; SCREW15 1; SCREW16 1; SCREW18 1; SCREW19 1; SCREW20 1; U1 2 15; U15 7; U23 7

## Via types
v1: diameter 0.61, hole 0.305, Top Layer to Bottom Layer, 40 vias

## Routing (per net, layer and track width the routed paths; a pad name or vN(x,y) marks a point on that pad's centre or on a via; arc(x,y) is an arc through that point)
+5V: length 215.4
  Top Layer w0.508: 80.67,32.2 80.67,32.8 ; U14.7 28.9,25.46 ; U1.11 33.4,76.75
  Top Layer w0.762: D8.1 38.08,4.87 arc(38.1,4.88) C32.2 C31.2 38.1,9.45 arc(38.1,9.46) R22.1 31.26,9.47 ; v1(90.76,61.8) R54.1 arc(90.77,60.18) 90.77,60.17 C58.2 ; 31.26,9.47 27.76,9.47 arc(27.57,9.39) NOREF.1 ; 31.26,9.47 arc(31.23,9.48) 31.22,9.5 R16.2 v1(32.6,12.96) ; C58.2 90.77,55.51 arc(90.77,55.5) C59.2 arc(90.75,55.47) 90.72,55.45 D24.1 ; C58.2 arc(90.75,57.82) 90.69,57.8 80.7,57.8 arc(80.24,57.99) 80.04,58.46 NOREF#4.1 ; 28.9,25.46 30.47,25.46 arc(30.85,25.62) C34.1 arc(31,26) 31.01,26 v1(32.6,26) 34.11,26 arc(34.92,26.34) 35.26,27.15 35.26,30.77 arc(35.27,30.8) C29.1 34.42,30.82 arc(33.84,31.06) 33.6,31.64 33.6,33.01 arc(33.61,33.03) U15.8 ; v1(78.9,36) 78.9,34.69 arc(78.87,34.63) 78.81,34.6 79.8,34.6 arc(80.42,34.34) 80.67,33.73 80.67,32.8 ; v1(78.8,92.4) 78.8,93.6 78.9,93.7 arc(78.87,93.77) R55.1 ; D1.1 38.25,54.97 arc(38.29,54.99) C19.2 arc(38.34,55.04) 38.36,55.08 R10.1 v1(36.3,59.59) ; v1(76.6,70.2) 78.15,70.2 arc(78.15,70.2) C65.2 ; 80.38,70.19 78.26,70.19 ; R37.1 78.2,13.1 arc(79.49,12.56) 80.03,11.27 NOREF#3.1 arc(80.2,9.43) 80.61,9.6 R35.1 C44.2 arc(90.99,4.99) 90.96,4.97 D16.1
  内层1 w0.762: v1(36.3,59.59) 35.01,59.59 arc(33.94,60.03) 33.5,61.1 v1(33.5,76.8)
  Inner2 w0.762: v1(78.8,92.4) 78.8,79.4 arc(78.45,78.55) 77.6,78.2 77.5,78.2 arc(76.86,77.94) 76.6,77.3 v1(76.6,70.2) 76.6,67.5 arc(76.86,66.86) 77.5,66.6 89.5,66.6 arc(90.39,66.23) 90.76,65.34 v1(90.76,61.8) ; v1(32.6,12.96) v1(32.6,26) ; v1(78.9,36) 78.9,10.15 arc(79.23,9.35) NOREF#3.1
-5V: length 211.5
  Top Layer w0.508: U1.10 31.8,75.48 ; 75.1,27.6 75.1,28.37 arc(75.11,28.39) U19.4
  Top Layer w0.762: D14.1 74.37,9.59 arc(74.78,9.43) NOREF#2.1 ; D14.1 64.25,7.46 arc(64.23,7.42) 64.19,7.4 arc(64.2,7.4) 64.2,7.39 C45.2 67.06,5.02 arc(67.09,5) D17.2 ; D14.1 64.25,13.01 ; NOREF#7.1 74.96,58.86 arc(74.65,58.11) 73.9,57.8 64.01,57.8 arc(63.98,57.8) 63.96,57.81 ; v1(13.3,59.52) D5.1 arc(11.62,59.5) 11.6,59.46 C20.2 arc(11.61,54.89) 11.64,54.87 D2.2 ; v1(20.35,19.15) 20.35,20.57 arc(20.34,20.61) R58.1 ; 18.69,9.72 D6.1 arc(11.88,9.71) 11.89,9.7 C30.2 arc(11.9,7.3) 11.9,7.29 C33.2 arc(11.91,4.89) 11.94,4.87 D9.2 ; 18.69,9.72 21.89,9.72 arc(22.26,9.57) NOREF#5.1 ; 18.69,9.72 arc(18.62,9.74) 18.6,9.8 R17.2 arc(18.65,13.08) 18.76,13.13 v1(20.36,13.13) ; 64.25,13.01 arc(64.23,13) 64.2,13 62.3,13 arc(61.52,13.32) 61.2,14.1 61.2,16.9 arc(61.58,17.82) 62.5,18.2 75.5,18.2 arc(76.41,18.58) 76.79,19.49 76.79,26.2 76.5,26.2 arc(75.51,26.61) 75.1,27.6 ; 64.25,13.01 arc(64.29,13.05) R36.2 ; v1(65.8,92.6) R56.2 ; C62.2 C63.2 76.85,79.95 arc(76.81,79.94) v1(76.8,79.9) ; v1(63.87,61.9) D22.1 arc(63.9,60.27) 63.91,60.25 63.91,57.9 arc(63.92,57.85) 63.96,57.81 ; 63.96,57.81 C60.2 66.92,55.5 arc(66.95,55.48) D25.2
  内层1 w0.762: v1(13.3,59.52) 29.26,59.52 arc(31.06,60.27) 31.8,62.06 v1(31.8,75.5)
  Inner2 w0.762: v1(20.36,13.13) 20.36,19.14 arc(20.36,19.15) v1(20.35,19.15) ; v1(63.87,61.9) 72.1,61.9 arc(73.16,62.34) 73.6,63.4 73.6,79.1 arc(73.83,79.67) 74.4,79.9 v1(76.8,79.9) 76.8,91.3 arc(76.42,92.22) 75.5,92.6 v1(65.8,92.6)
GND: length 4.6
  Top Layer w0.508: U15.4 41.1,36.84 ; U1.12 32,78.02 arc(32.24,78.12) v1(32.34,78.36)
OUT+: length 13.6
  Top Layer w0.508: R39.2 75,66.8 arc(75.42,66.97) 75.59,67.39 U23.1
  Top Layer w0.762: R39.2 73.65,66.05 arc(73.87,65.52) 74.4,65.3 76.38,65.3 arc(76.39,65.3) R40.1 C46.1
OUT-: length 13.8
  Top Layer w0.508: R42.1 75,82.8 arc(75.42,82.63) 75.59,82.2 U23.8
  Top Layer w0.762: C47.2 R44.2 arc(76.41,85.1) 76.41,85.1 74.8,85.1 arc(74.02,84.78) 73.7,84 R42.1
V_COM: length 5.8
  Top Layer w0.762: PR16.2 72.4,92.16 arc(71.84,90.81) H15.1
VCOM: length 28.2
  Top Layer w0.508: U23.2 76.87,74.23 arc(76.67,74.7) 76.2,74.9 76.19,74.89 C61.2 v1(71.1,74.89) arc(72.01,74.92) 72.91,74.9
  Inner2 w0.508: v1(71.1,74.89) 68.51,74.89 arc(68.15,75.04) 68,75.4 68,90.2 arc(67.98,90.24) H15.2
$1N1182: length 2.4
  Top Layer w0.762: R11.2 9.46,59.53 arc(9.46,59.53) D5.2
$1N1188: length 2.4
  Top Layer w0.762: R10.2 42.74,59.59 arc(42.75,59.59) D4.2
$1N1389: length 7.3
  Top Layer w0.762: D1.2 32.22,52.63 arc(31.46,52.94) CN24.6 CN24.5
$1N1390: length 7.2
  Top Layer w0.762: D2.1 17.48,52.53 arc(18.31,52.87) CN24.1 CN24.2
$1N1445: length 4.1
  Top Layer w0.508: U1.5 17.82,78.02 arc(17.45,77.87) 17.3,77.5 R3.1
$1N1450: length 14.4
  Top Layer w0.508: v1(28.1,79.3) 29.83,79.3 arc(29.83,79.3) U1.13 ; R1.2 v1(23.5,86.2)
  Inner2 w0.508: v1(23.5,86.2) 23.5,79.9 arc(23.68,79.48) 24.1,79.3 v1(28.1,79.3)
$1N1595: length 43.1
  Top Layer w0.508: 15,71.29 15.07,71.21 R4.2 ; 15,71.29 15,79.27 ; 15,71.29 15,64.57 ; 15,79.27 15.02,79.29 U1.4 ; 15,79.27 PR3.3
  Top Layer w0.762: PR3.3 15,92.9 arc(14.85,93.25) R2.2 ; 12.5,64.57 15,64.57
$1N1622: length 17.8
  Top Layer w0.762: R2.1 PR3.2 ; PR3.2 PR3.1 ; PR3.2 arc(12.76,89.33) 12.87,89.07 H11.2
$1N1784: length 33.1
  Top Layer w0.508: R5.1 35.3,67.9 arc(35.87,68.13) R12.2 ; U1.6 v1(23.3,76.75)
  Top Layer w0.762: PR13.2 PR13.3 arc(28.63,63.8) 29.05,64.83 R5.1
  Inner2 w0.508: PR13.2 25.1,75.7 arc(24.79,76.45) 24.05,76.75 v1(23.3,76.75)
$1N1790: length 23
  Top Layer w0.508: U1.7 v1(22.4,75.48)
  Top Layer w0.762: R5.2 C24.2 23.13,63.9 arc(22.97,63.53) PR13.1
  Inner2 w0.508: v1(22.4,75.48) 22.4,63.86 arc(22.45,63.6) PR13.1
$1N1856: length 14
  Top Layer w0.508: v1(18.4,80.6) 20.3,80.6 arc(20.33,80.59) U1.3
  Inner2 w0.508: H11.6 14.66,73.26 arc(15.32,73.54) 15.6,74.2 15.6,79.7 arc(15.86,80.34) 16.5,80.6 v1(18.4,80.6)
$1N1869: length 16.7
  Top Layer w0.508: v1(18.4,86.2) R1.1
  Inner2 w0.508: v1(18.4,86.2) 15.3,86.2 arc(14.66,85.94) 14.4,85.3 14.4,77 arc(14.05,76.15) 13.2,75.8 H11.4
$1N1910: length 31.8
  Top Layer w0.508: U1.1 22.5,83.1 arc(22.5,83.1) 22.5,83.1 ; C2.2 33,86.1 arc(33.03,86.17) v1(33.1,86.2)
  Top Layer w0.762: C2.2 36.11,85.09 arc(36.67,84.86) 36.9,84.3 36.9,78.37 arc(36.91,78.35) H12.1
  Inner2 w0.508: v1(22.52,83.1) 22.52,88.02 arc(22.75,88.57) 23.3,88.8 32.2,88.8 arc(32.84,88.54) 33.1,87.9 v1(33.1,86.2)
$1N1976: length 20
  Top Layer w0.508: U1.16 32.99,83.1 arc(33,83.1) C2.1 arc(33,83.1) 33.01,83.1 v1(34.5,83.1)
  Top Layer w0.762: R7.1 40.17,89.58 arc(40.13,89.48) PR6.2
  Inner2 w0.508: v1(34.5,83.1) 38.6,83.1 arc(39.59,83.51) 40,84.5 40,89.42 arc(40.01,89.43) PR6.2
$1N1981: length 38.7
  Top Layer w0.508: R6.1 27,81.3 arc(27.23,80.73) 27.8,80.5 29.77,80.5 arc(29.82,80.52) U1.14 33.44,80.56 arc(34.33,80.19) 34.7,79.3 34.7,76.4 arc(34.88,75.98) 35.3,75.8 H12.3
  Inner2 w0.508: H12.3 34.6,75.8 arc(34.11,75.59) 33.9,75.1 33.9,67.5 arc(34.13,66.93) 34.7,66.7 39.3,66.7 arc(39.79,66.49) 40,66 40,64.6 arc(40.01,64.58) 40.03,64.57
$1N2040: length 35
  Top Layer w0.508: R6.2 arc(25.46,86.01) 25.65,85.55 25.65,75.61 arc(26.05,74.63) 27.03,74.23 29.82,74.23 arc(29.83,74.23) U1.9 29.84,72 arc(29.61,71.44) C3.2
  Inner2 w0.508: v1(29.8,73.11) 31.09,73.11 arc(31.52,72.93) 31.7,72.5 31.7,65.4 arc(31.93,64.83) 32.5,64.6 37.5,64.6 arc(37.52,64.59) 37.53,64.57
$1N2142: length 14.7
  Top Layer w0.762: R12.1 38.6,68.7 arc(39.24,68.96) 39.5,69.6 39.5,78.31 arc(39.49,78.33) H12.2 39.47,81.88 arc(39.56,82.11) 39.79,82.2
$1N2254: length 53.9
  Top Layer w0.508: U1.8 24.06,74.21 arc(24.55,74.01) 24.75,73.52 24.75,71.91 arc(24.96,71.42) 25.45,71.21 27.05,71.21 arc(27.05,71.21) C3.1 27.05,70.05 arc(27.21,69.66) 27.6,69.5 33.2,69.5 arc(33.91,69.79) 34.2,70.5 34.2,72.4 arc(34.43,72.97) 35,73.2 36.87,73.2 arc(36.91,73.22) H12.5
  Top Layer w0.762: R7.2 42.17,89.8 arc(42.27,89.55) PR6.3
  Inner2 w0.508: H12.5 36.93,71.47 arc(37.16,70.93) 37.7,70.7 41.8,70.7 arc(42.22,70.88) 42.4,71.3 42.4,89.32 arc(42.44,89.4) PR6.3
$1N2357: length 11
  Top Layer w0.762: H11.5 H11.3 H11.1 10.33,81.07 arc(10.03,81.8) 9.3,82.1 7.71,82.1 arc(7.7,82.1) C1.2
$1N2379: length 4.9
  Top Layer w0.762: C1.1 2.85,84.11 arc(2.84,84.11) U11.5
$1N2488: length 25.3
  Top Layer w0.508: 21.13,67.9 18.6,67.9 arc(17.96,67.64) 17.7,67 17.7,63.7 arc(17.38,62.92) 16.6,62.6 8,62.6 arc(7.43,62.83) 7.2,63.4 7.2,65 arc(6.94,65.64) 6.3,65.9 2.97,65.9 arc(2.93,65.92) U12.5
$1N2539: length 11.9
  Top Layer w0.762: C4.2 41.59,76.51 arc(42.06,75.37) 43.2,74.9 47.04,74.9 arc(47.06,74.91) U13.5
$1N3084: length 20.1
  Top Layer w0.508: R19.1 R59.2 arc(12.32,23.8) 12.29,23.86 R13.2 ; U14.2 20.04,25.46 arc(18.24,26.2) 17.5,28 arc(17.15,28.85) 16.3,29.2 14.61,29.2 arc(14.6,29.2) C25.1
  Top Layer w0.762: R13.2 C25.1
$1N3090: length 23.6
  Top Layer w0.508: 13,16.5 16.7,16.5 arc(17.48,16.82) 17.8,17.6 17.8,22.3 arc(18.35,23.64) 19.69,24.19 U14.3 ; 13,16.5 13,21.16 arc(12.82,21.59) R59.1 ; 13,16.5 C26.2 ; 13,16.5 11.97,16.5 arc(11.97,16.5) 11.96,16.49
  Top Layer w0.762: 11.96,16.49 R14.2
$1N3242: length 9.7
  Top Layer w0.508: R18.1 arc(36.24,23.82) 35.32,24.2 27.68,24.2 arc(27.67,24.2) U14.6
$1N3248: length 5.5
  Top Layer w0.508: C27.2 R15.2 arc(30.99,22.91) 30.98,22.92 U14.5
$1N3433: length 9.2
  Top Layer w0.508: H2.2 20,28.99 arc(20.66,27.39) U14.1
$1N3547: length 24.5
  Top Layer w0.508: U14.8 27.67,34.66 arc(26.92,36.46) 25.13,37.2 24.2,37.2 arc(22.86,37.76) 22.3,39.1 22.3,41.07 ; 19.8,41.07 22.3,41.07 ; 22.3,41.07 26.27,41.07 arc(26.36,41.11) R20.2
$1N3556: length 12.9
  Top Layer w0.508: v1(29.6,36.84) 33.62,36.84 arc(33.63,36.84) U15.5
  Inner2 w0.508: H2.3 22.54,35.84 arc(22.82,36.53) 23.51,36.81 29.57,36.81 arc(29.59,36.82) v1(29.6,36.84)
$1N3634: length 10.2
  Top Layer w0.508: R20.1 27.85,39.2 arc(28.28,39.02) 28.46,38.59 28.46,36.47 arc(28.73,35.82) 29.38,35.55 33.6,35.55 arc(33.62,35.56) U15.6
$1N3650: length 11.2
  Top Layer w0.508: PR1.2 24.95,16.87 arc(25.31,17.75) 26.19,18.11 30.13,18.11 arc(30.75,18.37) 31.01,18.99 31.01,20.89 arc(31.01,20.9) R15.1
$1N3654: length 3.8
  Top Layer w0.508: PR1.3 31.11,14.85 arc(31.19,14.89) R16.1
$1N3658: length 3.9
  Top Layer w0.508: R17.1 22.34,14.96 arc(22.42,14.93) PR1.1
$1N3766: length 11.8
  Top Layer w0.508: R18.2 C28.2 41.2,20.9 arc(41.69,21.11) 41.9,21.6 H6.2 arc(41.9,22.54) 41.91,22.54 U16.5
$1N3943: length 9.5
  Top Layer w0.508: R13.1 12.25,31.17 arc(11.43,30.62) 10.46,30.43 H7.2 arc(7.5,30.44) 7.48,30.45 U17.5
$1N3949: length 7.9
  Top Layer w0.762: U18.5 7.43,14.52 arc(7.48,14.5) H8.2 10.66,14.45 arc(10.68,14.46) R14.1
$1N4144: length 17.5
  Top Layer w0.508: U15.1 37.71,33.03 arc(37.7,33.04) v1(37.7,33.04)
  Inner2 w0.508: H3.4 31.09,33.99 arc(31.37,33.31) 32.05,33.03 37.69,33.03 arc(37.7,33.03) v1(37.7,33.04)
$1N4148: length 13.6
  Top Layer w0.508: v1(37.6,34.34) 39.14,34.34 arc(39.16,34.33) U15.2
  Inner2 w0.508: H3.3 33.63,35.58 arc(33.99,34.72) 34.85,34.36 37.58,34.36 arc(37.59,34.35) v1(37.6,34.34)
$1N4153: length 9.9
  Top Layer w0.508: H3.2 36.17,36.67 arc(36.5,35.87) 37.3,35.54 39.14,35.54 arc(39.16,35.55) U15.3
$1N4622: length 2.1
  Top Layer w0.762: R22.2 42.01,9.47 arc(42.09,9.5) D7.2
$1N4631: length 2
  Top Layer w0.762: R21.2 9.67,9.72 arc(9.67,9.72) D6.2
$1N4633: length 7.1
  Top Layer w0.762: CN25.2 CN25.1 arc(18.31,2.9) 17.4,2.53 D9.1
$1N4634: length 7.1
  Top Layer w0.762: D8.2 32.47,2.53 arc(31.56,2.9) CN25.6 CN25.5
$1N4767: length 4.3
  Top Layer w0.762: C35.2 arc(24.3,20.63) 24.27,20.62 R58.2 22.3,22.88 arc(22.29,22.91) U14.4
$1N5205: length 6.6
  Top Layer w0.508: H2.1 17.46,40.91 arc(17.41,41.03) 17.3,41.07
$2N1502: length 7.6
  Top Layer w0.762: U20.5 62.49,22.44 arc(62.5,22.43) H9.1 65.33,22.43 arc(65.38,22.45) R27.1
$2N1503: length 46.4
  Top Layer w0.508: R28.1 v1(83.9,34.8) ; R26.2 67.9,27.04 arc(67.9,27.05) v1(67.91,27.06) 71,27.06 arc(71.63,27.32) 71.89,27.95 71.89,29.92 arc(72.18,30.63) 72.89,30.92 75.11,30.92 arc(75.12,30.92) U19.2
  Top Layer w0.762: R27.2 R26.2
  Inner2 w0.508: v1(83.9,34.8) 83.9,37.5 arc(83.72,37.92) 83.3,38.1 68.9,38.1 arc(68.19,37.81) 67.9,37.1 67.91,37.09 v1(67.91,27.06)
$2N1504: length 4.5
  Top Layer w0.508: R24.2 R23.1 R25.2
$2N1511: length 7.3
  Top Layer w0.762: D16.2 84.82,2.63 arc(84.06,2.94) CN27.6 CN27.5
$2N1513: length 2.1
  Top Layer w0.508: D14.2 60,9.59 arc(60,9.6) R34.2
$2N1515: length 2.1
  Top Layer w0.762: R35.2 95.04,9.6 arc(95.05,9.6) D15.2
$2N1521: length 4.3
  Top Layer w0.508: R36.1 67.17,15.1 arc(67.83,14.83) PR15.1
$2N1522: length 15.7
  Top Layer w0.508: v1(69.8,28.5) R25.1
  Inner2 w0.508: PR15.2 70.6,27.7 arc(70.37,28.27) v1(69.8,28.5)
$2N1523: length 4.3
  Top Layer w0.508: R37.2 74.03,15.1 arc(73.37,14.83) PR15.3
$2N1527: length 27.6
  Top Layer w0.508: 75.13,32.2 72.9,32.2 arc(72.12,32.53) 71.8,33.3 71.8,36.2 arc(72.15,37.05) 73,37.4 84.8,37.4 arc(85.58,37.08) 85.9,36.3 R28.2 R30.2
$2N1528: length 5.7
  Top Layer w0.508: 83.9,29.69 R31.2 ; 83.9,29.69 R30.1 ; 83.9,29.69 arc(83.89,29.67) 83.88,29.66 80.67,29.66
$2N1531: length 18.3
  Top Layer w0.508: R31.1 87.57,28.53 arc(88.37,28.2) 88.7,27.4 88.7,15.1 arc(88.38,14.32) 87.6,14 86.87,14 arc(86.82,14.02) PR14.3
$2N1533: length 4.7
  Top Layer w0.508: R29.2 82.5,26.1 arc(81.21,26.64) 80.67,27.93 U19.5
$2N1535: length 32.9
  Top Layer w0.508: U19.7 v1(82.2,30.94) ; H10.1 96.96,22.51 arc(97.05,22.55) U22.5
  Inner2 w0.508: H10.1 84.32,22.51 arc(84.31,22.51) 84.3,22.49 ; 84.3,22.49 PR14.2 ; 84.3,22.49 84.3,29.8 arc(83.97,30.6) 83.16,30.94 v1(82.2,30.94)
$2N1536: length 6.9
  Top Layer w0.508: R23.2 68.9,30.7 v1(70,30.7) ; 75.13,29.66 v1(73.6,29.66)
  Inner2 w0.508: v1(70,30.7) 72.56,30.7 arc(73.3,30.4) v1(73.6,29.66)
$2N1574: length 7.3
  Top Layer w0.762: D17.1 70.18,2.63 arc(70.94,2.94) CN27.1 CN27.2
$2N2025: length 20
  Top Layer w0.508: U23.4 v1(80.5,72.3) ; v1(84.5,68.2) R41.2
  Top Layer w0.762: C46.2 R40.2 81.88,65.28 arc(82.67,65.61) 83,66.4 R41.2
  Inner2 w0.508: v1(80.5,72.3) 83.9,72.3 arc(84.33,72.12) 84.5,71.7 v1(84.5,68.2)
$2N2050: length 20.3
  Top Layer w0.508: v1(84.5,82) R45.2 ; U23.5 v1(80.5,77.7)
  Top Layer w0.762: R45.2 83,83.9 arc(82.65,84.75) 81.8,85.1 R44.1 C47.1
  Inner2 w0.508: v1(80.5,77.7) 83.91,77.7 arc(84.33,77.88) 84.5,78.3 v1(84.5,82)
$2N2321: length 13
  Top Layer w0.762: R49.2 86.7,73.19 arc(86.47,73.76) C48.1 arc(85.9,74) 85.89,74 R46.1 83,70.5
$2N2326: length 13.2
  Top Layer w0.762: R45.1 R46.2 85.89,76 arc(85.9,76) C48.2 arc(86.54,76.25) 86.8,76.89 R50.2
$2N2399: length 9
  Top Layer w0.762: R42.2 R43.1 arc(71.43,79.56) 70.79,79.29 C50.1 arc(68.38,79.32) 68.35,79.33 R48.1
$2N2476: length 8.7
  Top Layer w0.762: R38.1 R39.1 arc(71.39,66.16) 70.75,65.89 C49.1 65.97,65.89 arc(65.96,65.9) R47.2
$2N2511: length 8.1
  Top Layer w0.762: U24.5 62.45,67.88 arc(62.49,67.9) H13.1 arc(62.51,67.91) 62.52,67.91 R47.1
$2N2915: length 8.3
  Top Layer w0.762: U25.5 62.49,81.86 arc(62.5,81.86) H14.1 65.35,81.87 arc(65.73,81.71) R48.2
$2N3082: length 10.7
  Top Layer w0.762: 92.79,81.9 U27.5 ; 88.81,84.28 88.81,81.79 arc(88.81,81.78) R50.1 92.67,81.78 arc(92.71,81.79) H17.1
$2N3086: length 11
  Top Layer w0.762: U26.5 92.79,67.94 arc(92.75,67.92) H16.1 88.73,67.87 arc(88.71,67.88) R49.1 arc(88.69,67.9) 88.69,67.89 88.69,65.4
$2N3632: length 7
  Top Layer w0.762: D24.2 84.26,53.11 arc(83.87,53.27) CN29.6 CN29.5
$2N3637: length 2.4
  Top Layer w0.762: R53.2 61.67,60.28 arc(61.67,60.28) D22.2
$2N3640: length 2.1
  Top Layer w0.762: R54.2 94.82,60.18 arc(94.83,60.18) 94.84,60.19
$2N3643: length 7.1
  Top Layer w0.762: D25.1 70.65,53.11 arc(71.04,53.27) CN29.1 CN29.2
$2N3838: length 7
  Top Layer w0.762: R57.2 R56.1 69.07,95.8 arc(69.66,95.56) PR16.1
$2N3844: length 4.4
  Top Layer w0.762: R55.2 75.73,95.8 arc(75.14,95.56) PR16.3

## Copper pours and planes (outline as drawn; the poured copper is in the pictures)
GND on Top Layer: -19.58,116.25 118.76,116.25 118.76,-26.28 -19.58,-26.28
GND on Bottom Layer: -11.41,112.74 126.96,112.74 126.96,-30.11 -11.41,-30.11
GND on 内层1: -8.93,115.22 125.72,115.22 125.72,-22.16 -8.93,-22.16

Small or netless copper shapes (teardrops, artwork), in the pictures only: 392 on Top Layer, 41 on Inner2

## Text on the board
Top Solder Mask Layer: 直流可调放大器 | UAF42 / 通用滤波器 | AD8138 / 差分放大器 | AD620
Top Silkscreen Layer: CS | SCK | SI | GND | 增益调节 | 偏置调节 | 手控 | 程控 | 接地 | 共模调节 | 内部放大输出 | VIN2 | VIN1 | VIN3 | Q值调节 | 内部放大器增益调节 | 中心频率调节 | 高通 | 带通 | 低通 | IN+ | IN- | OUT- | OUT+
